# EAGLE schematic mainboard (EAGLE 7.7.0), part 1 of 2
ACCOUNT_NAME: 2aaeli-gr; BRD_SHEET_NAME: Layout Work; PROJEKT_NAME: elmProject; REVISION: 2.0; SCH_SHEET_NAME: Schaltplan; USER_NAME: A.Flo/G.Raf/S.Sve
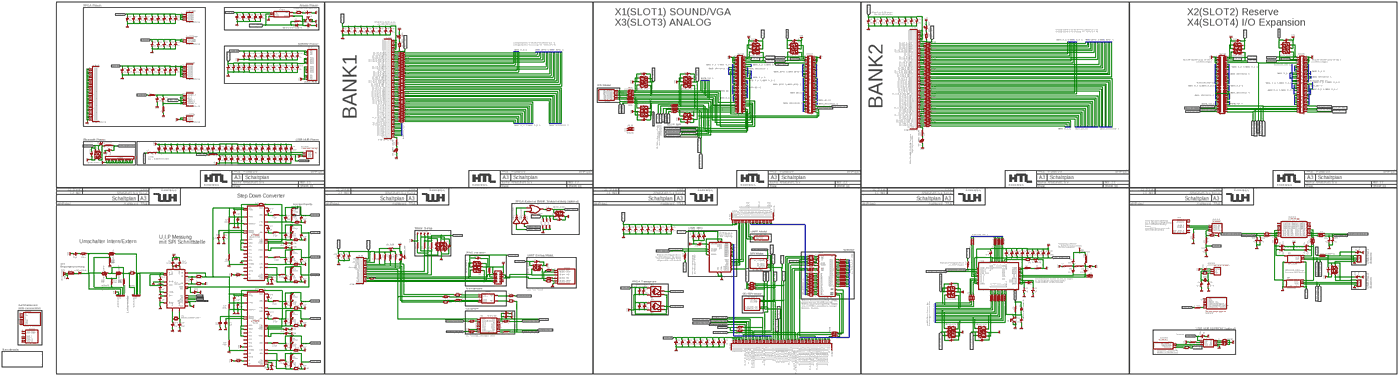
[diagram p0: schematic, sheet 1, overview]
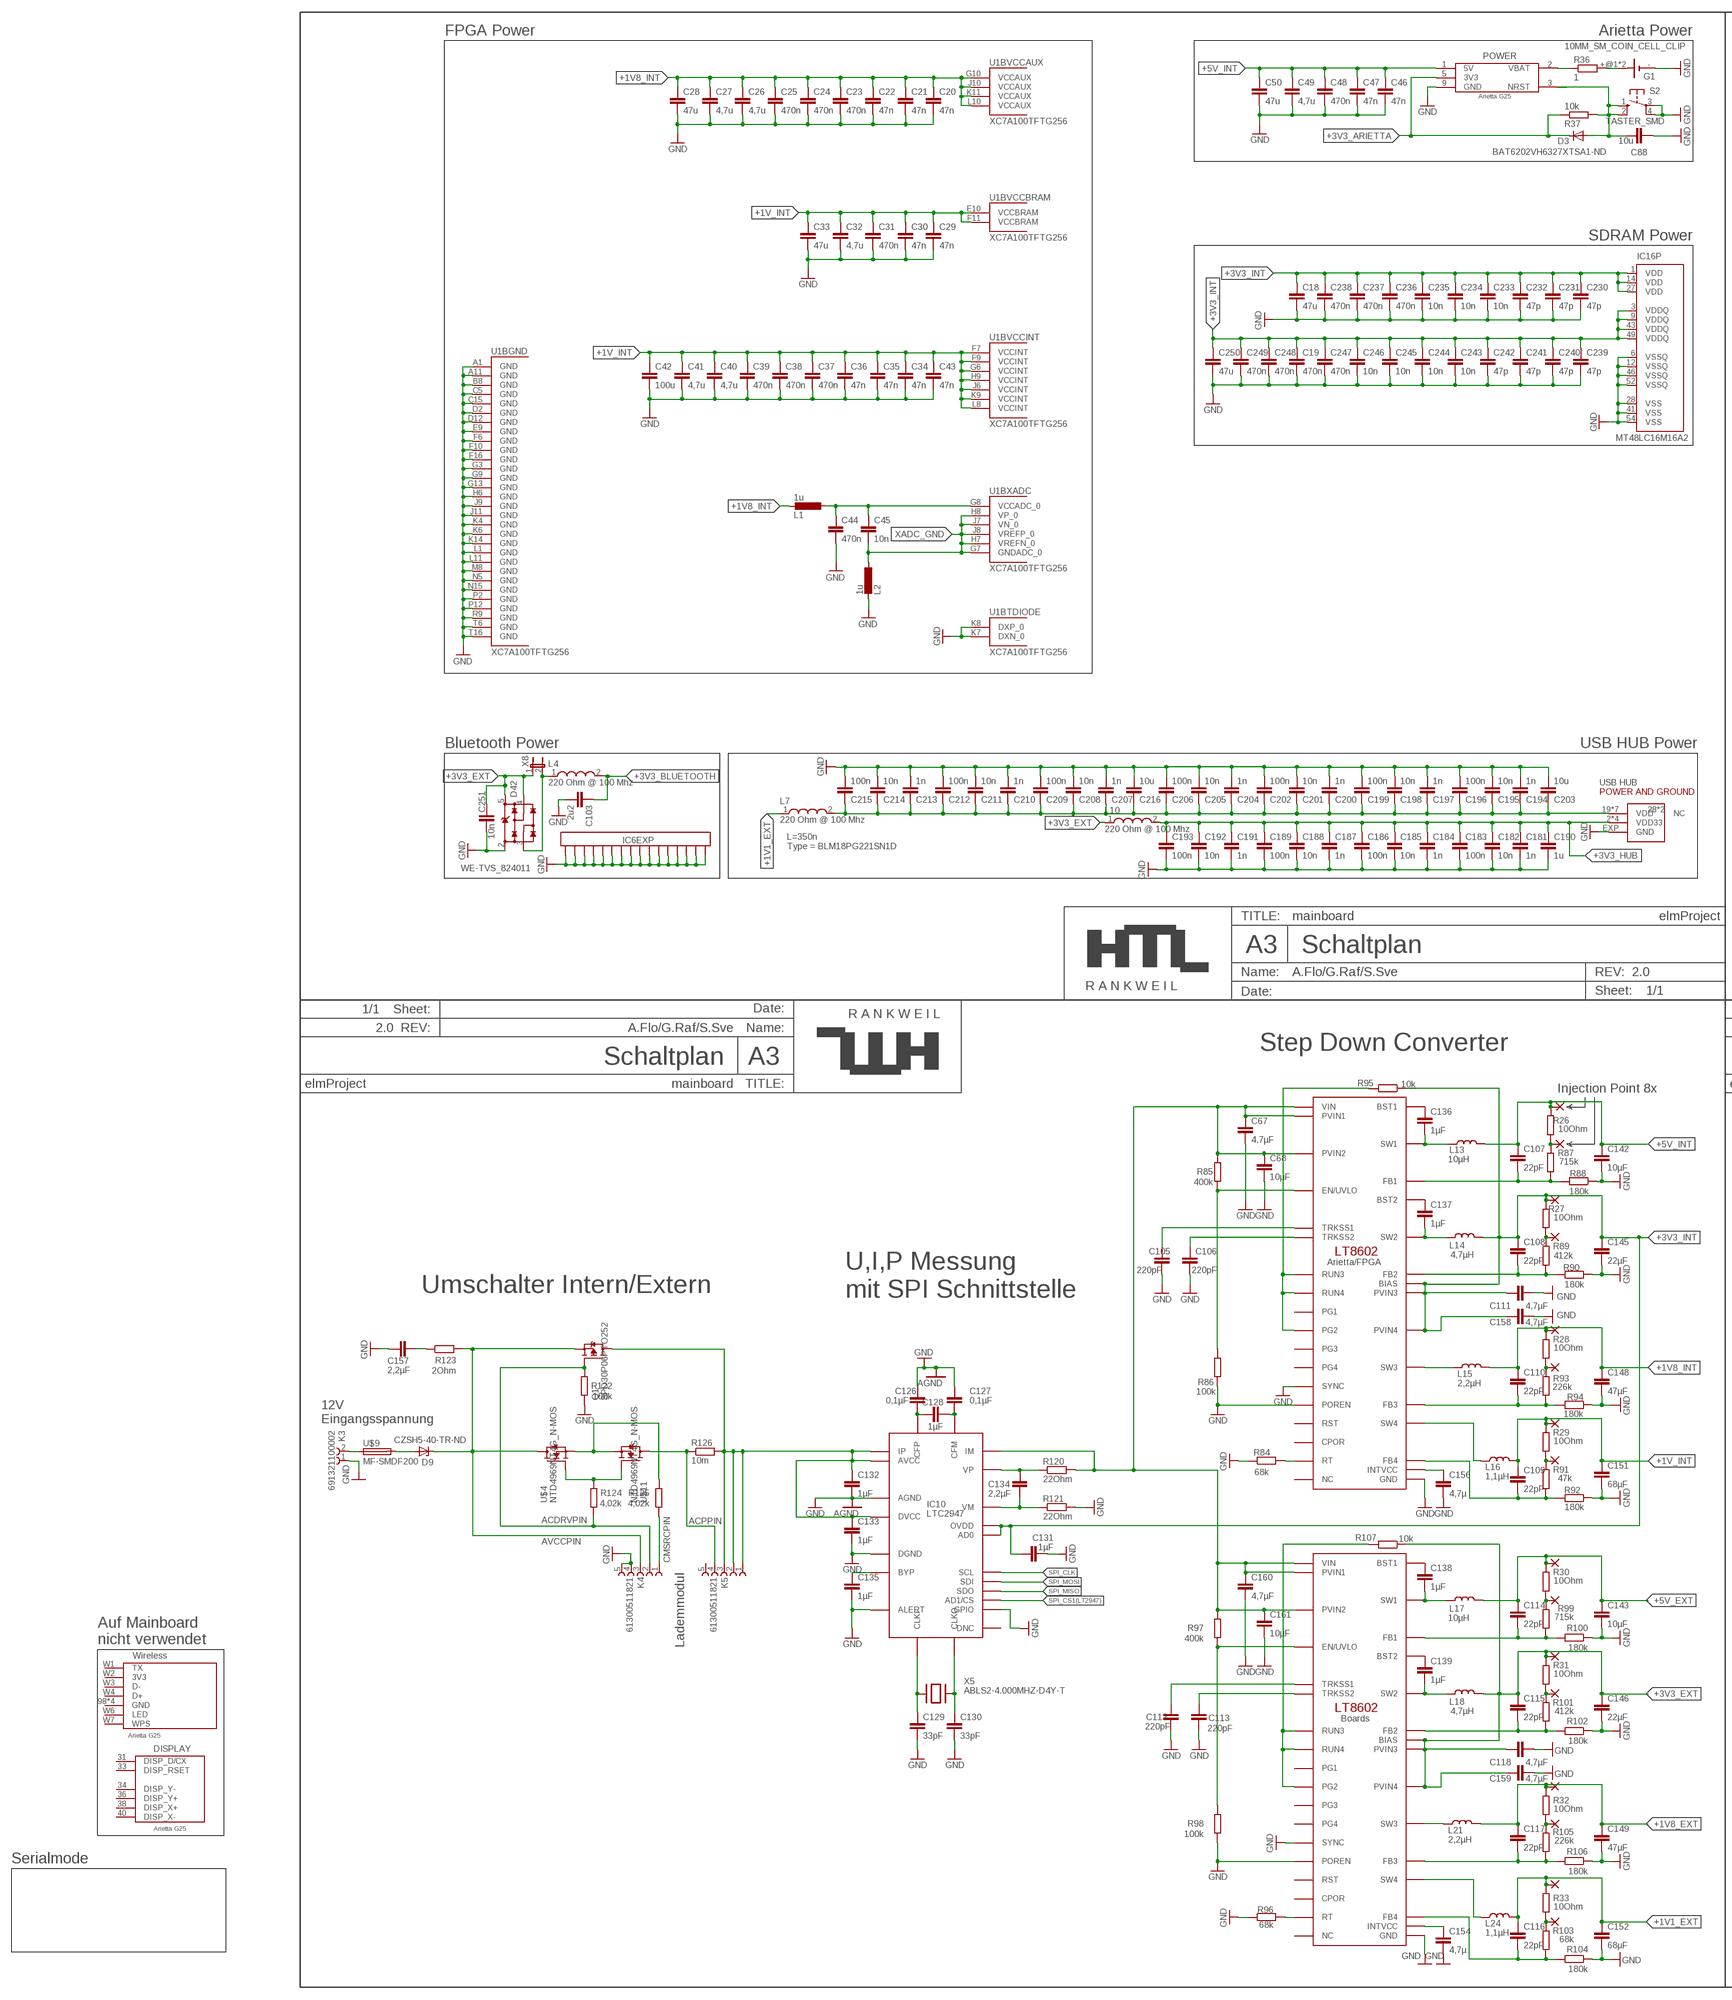
[diagram p1: schematic, sheet 1, part 1 of 5]
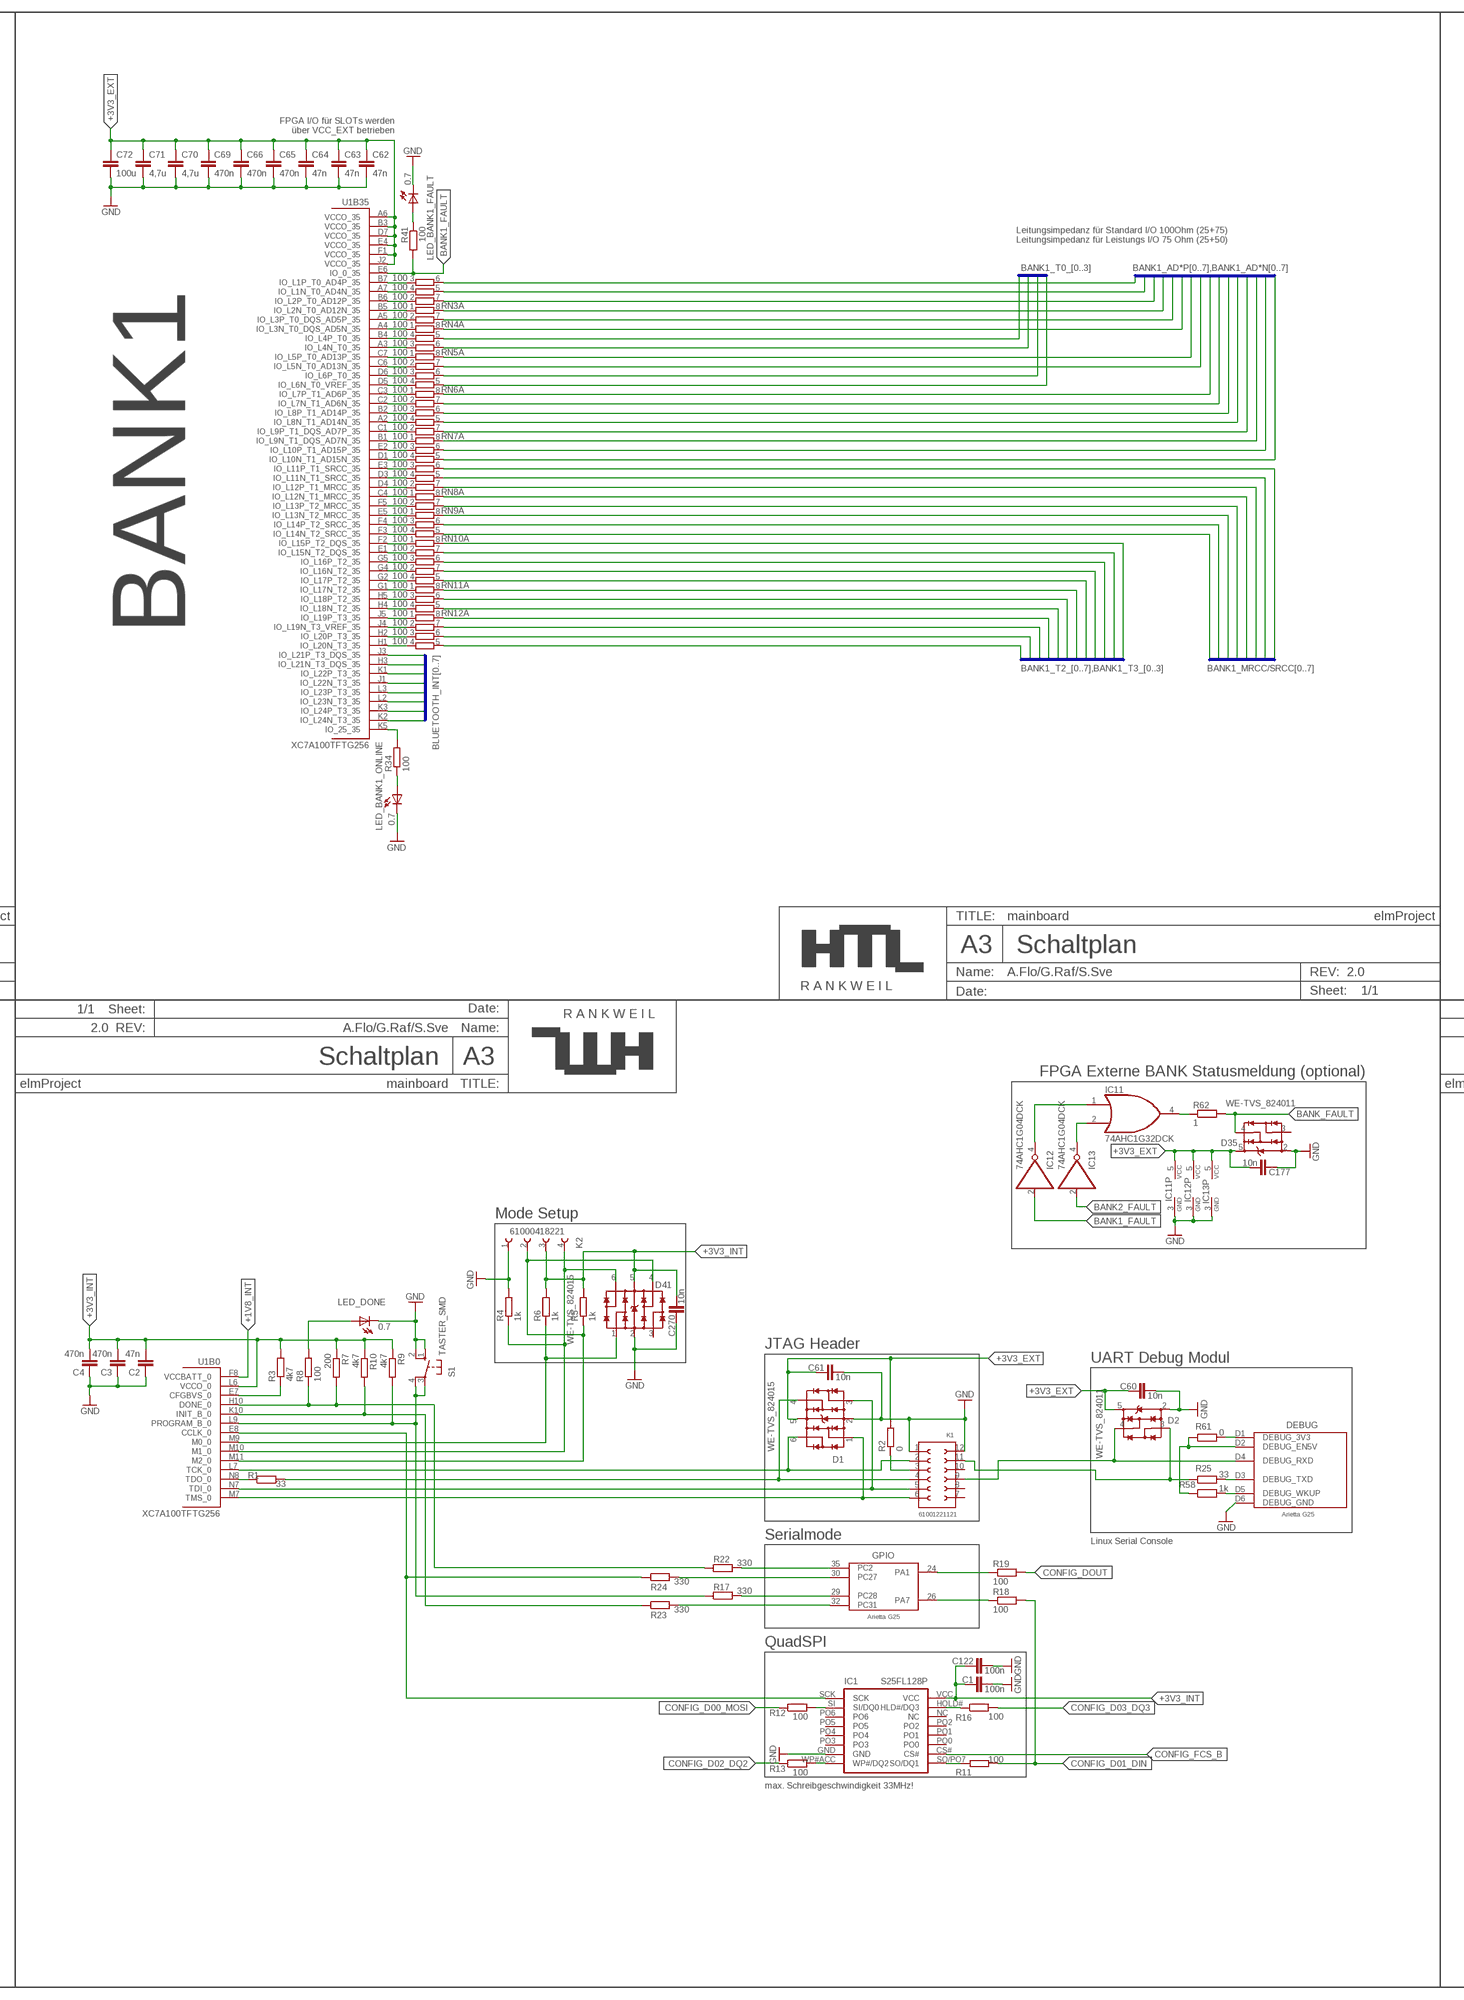
[diagram p2: schematic, sheet 1, part 2 of 5]
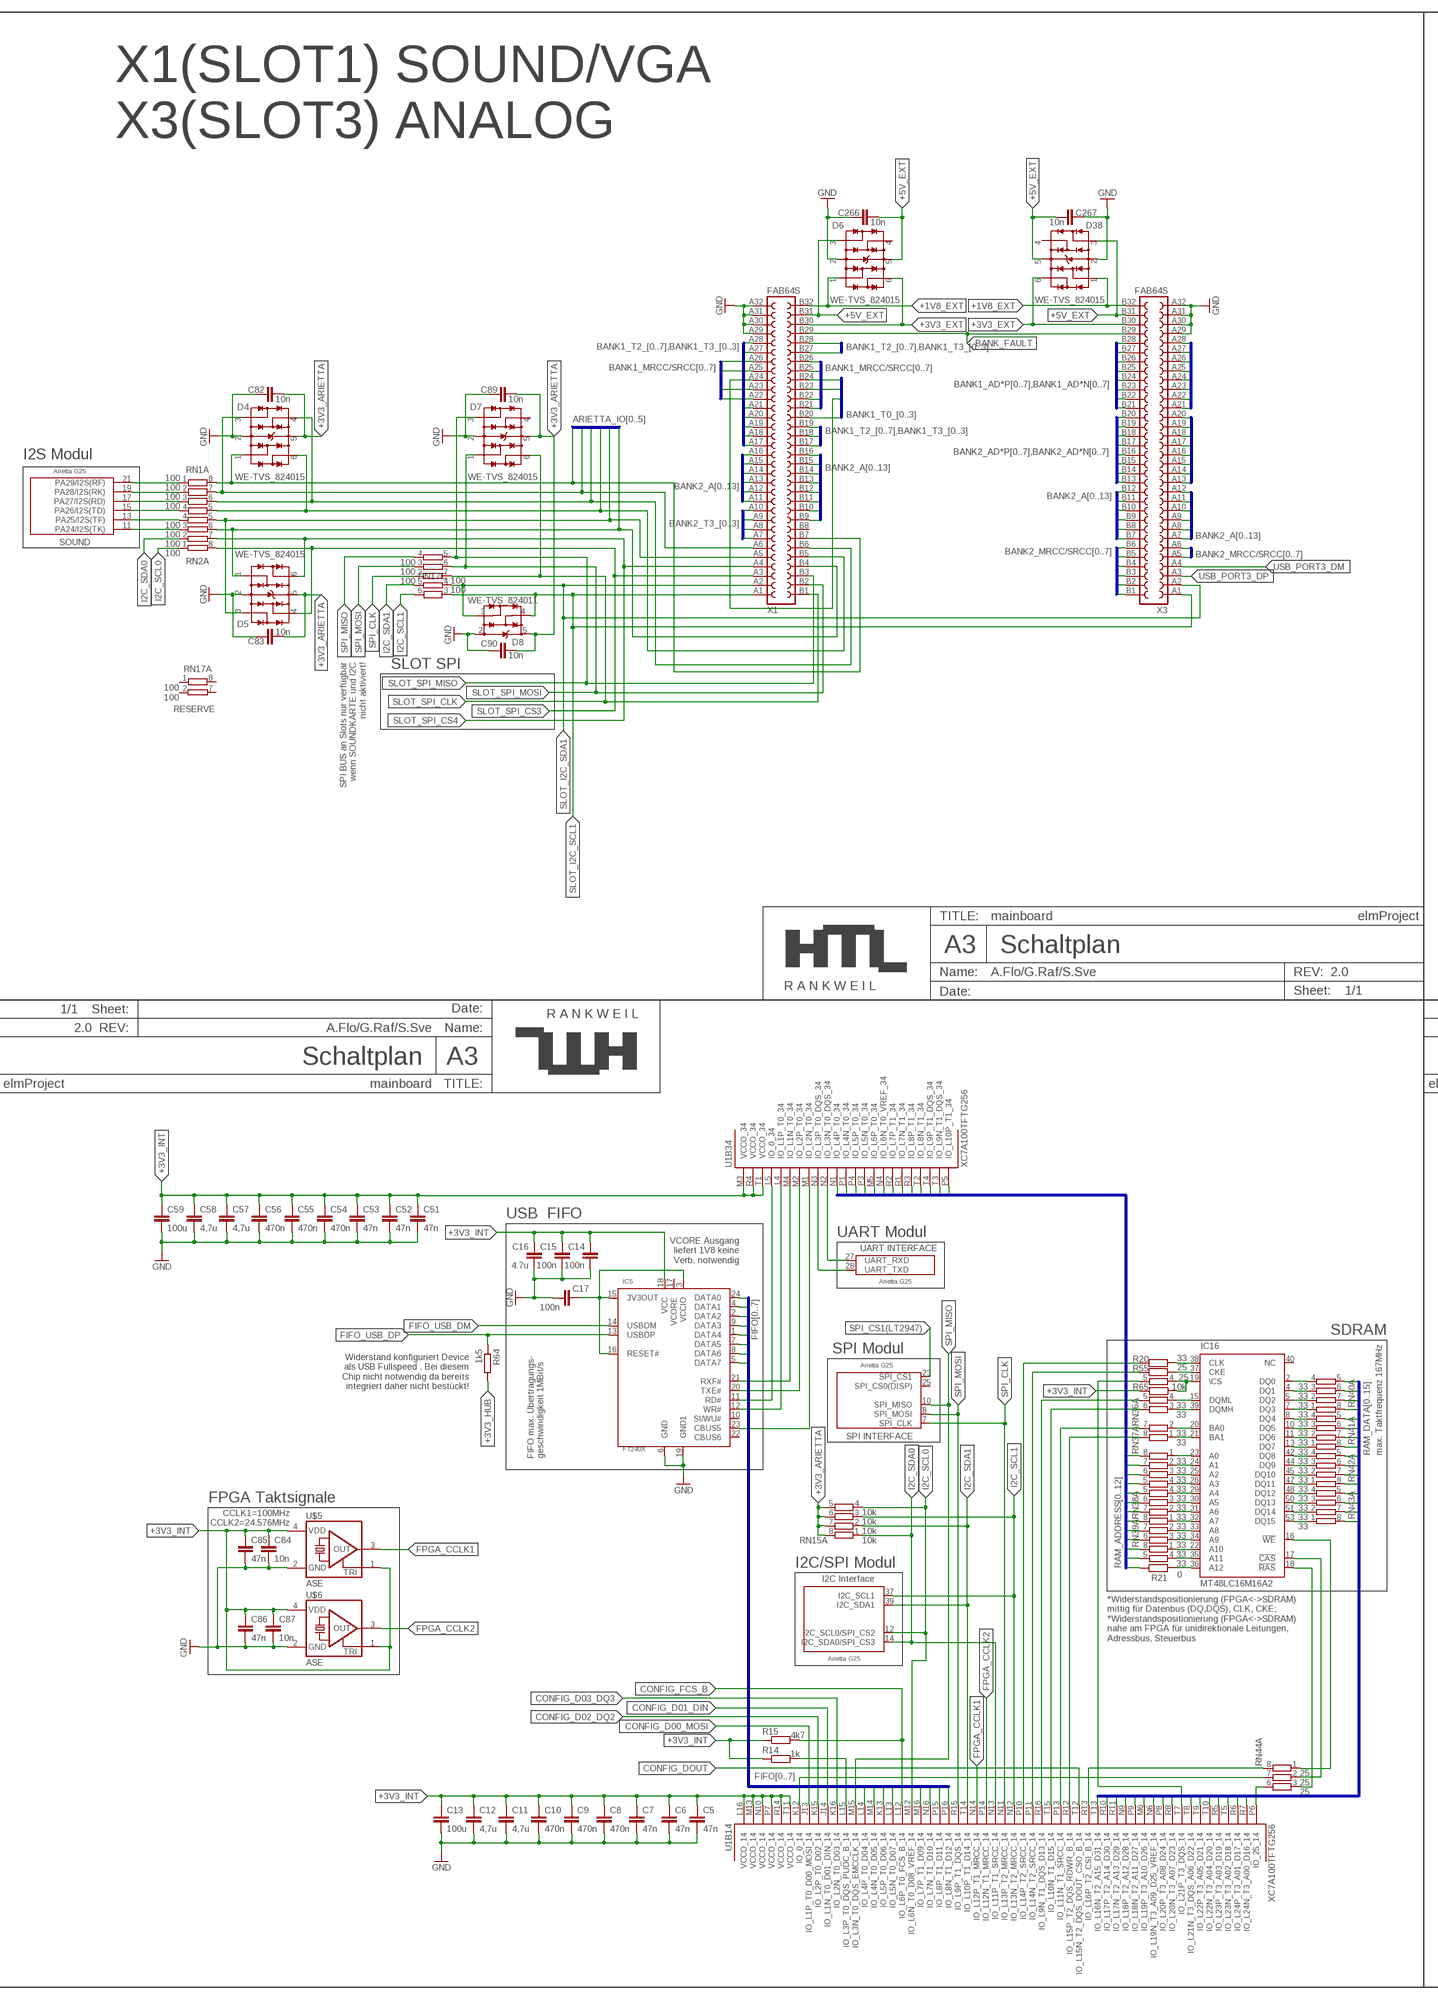
[diagram p3: schematic, sheet 1, part 3 of 5]
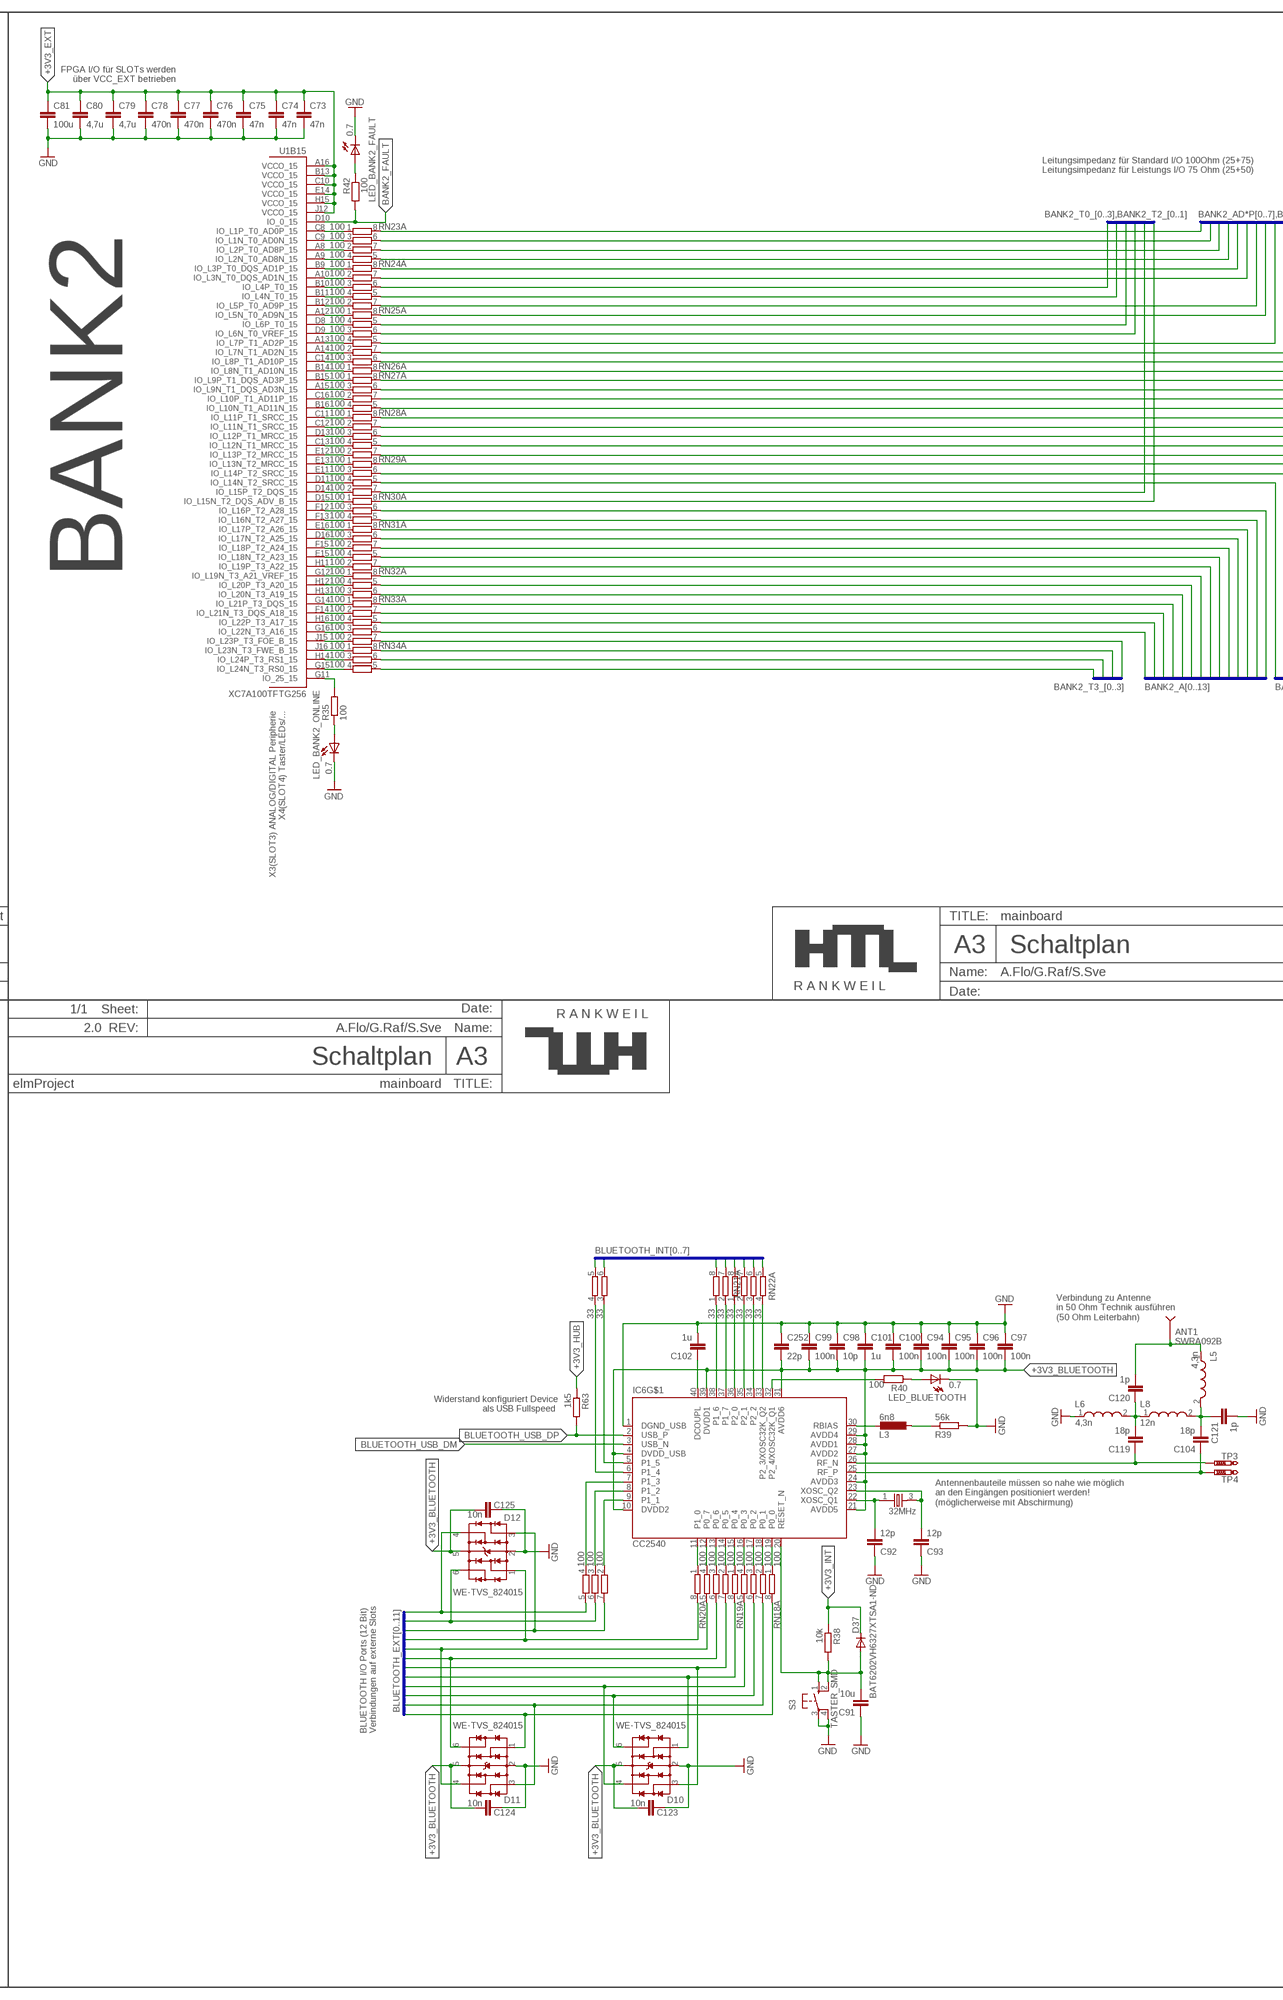
[diagram p4: schematic, sheet 1, part 4 of 5]
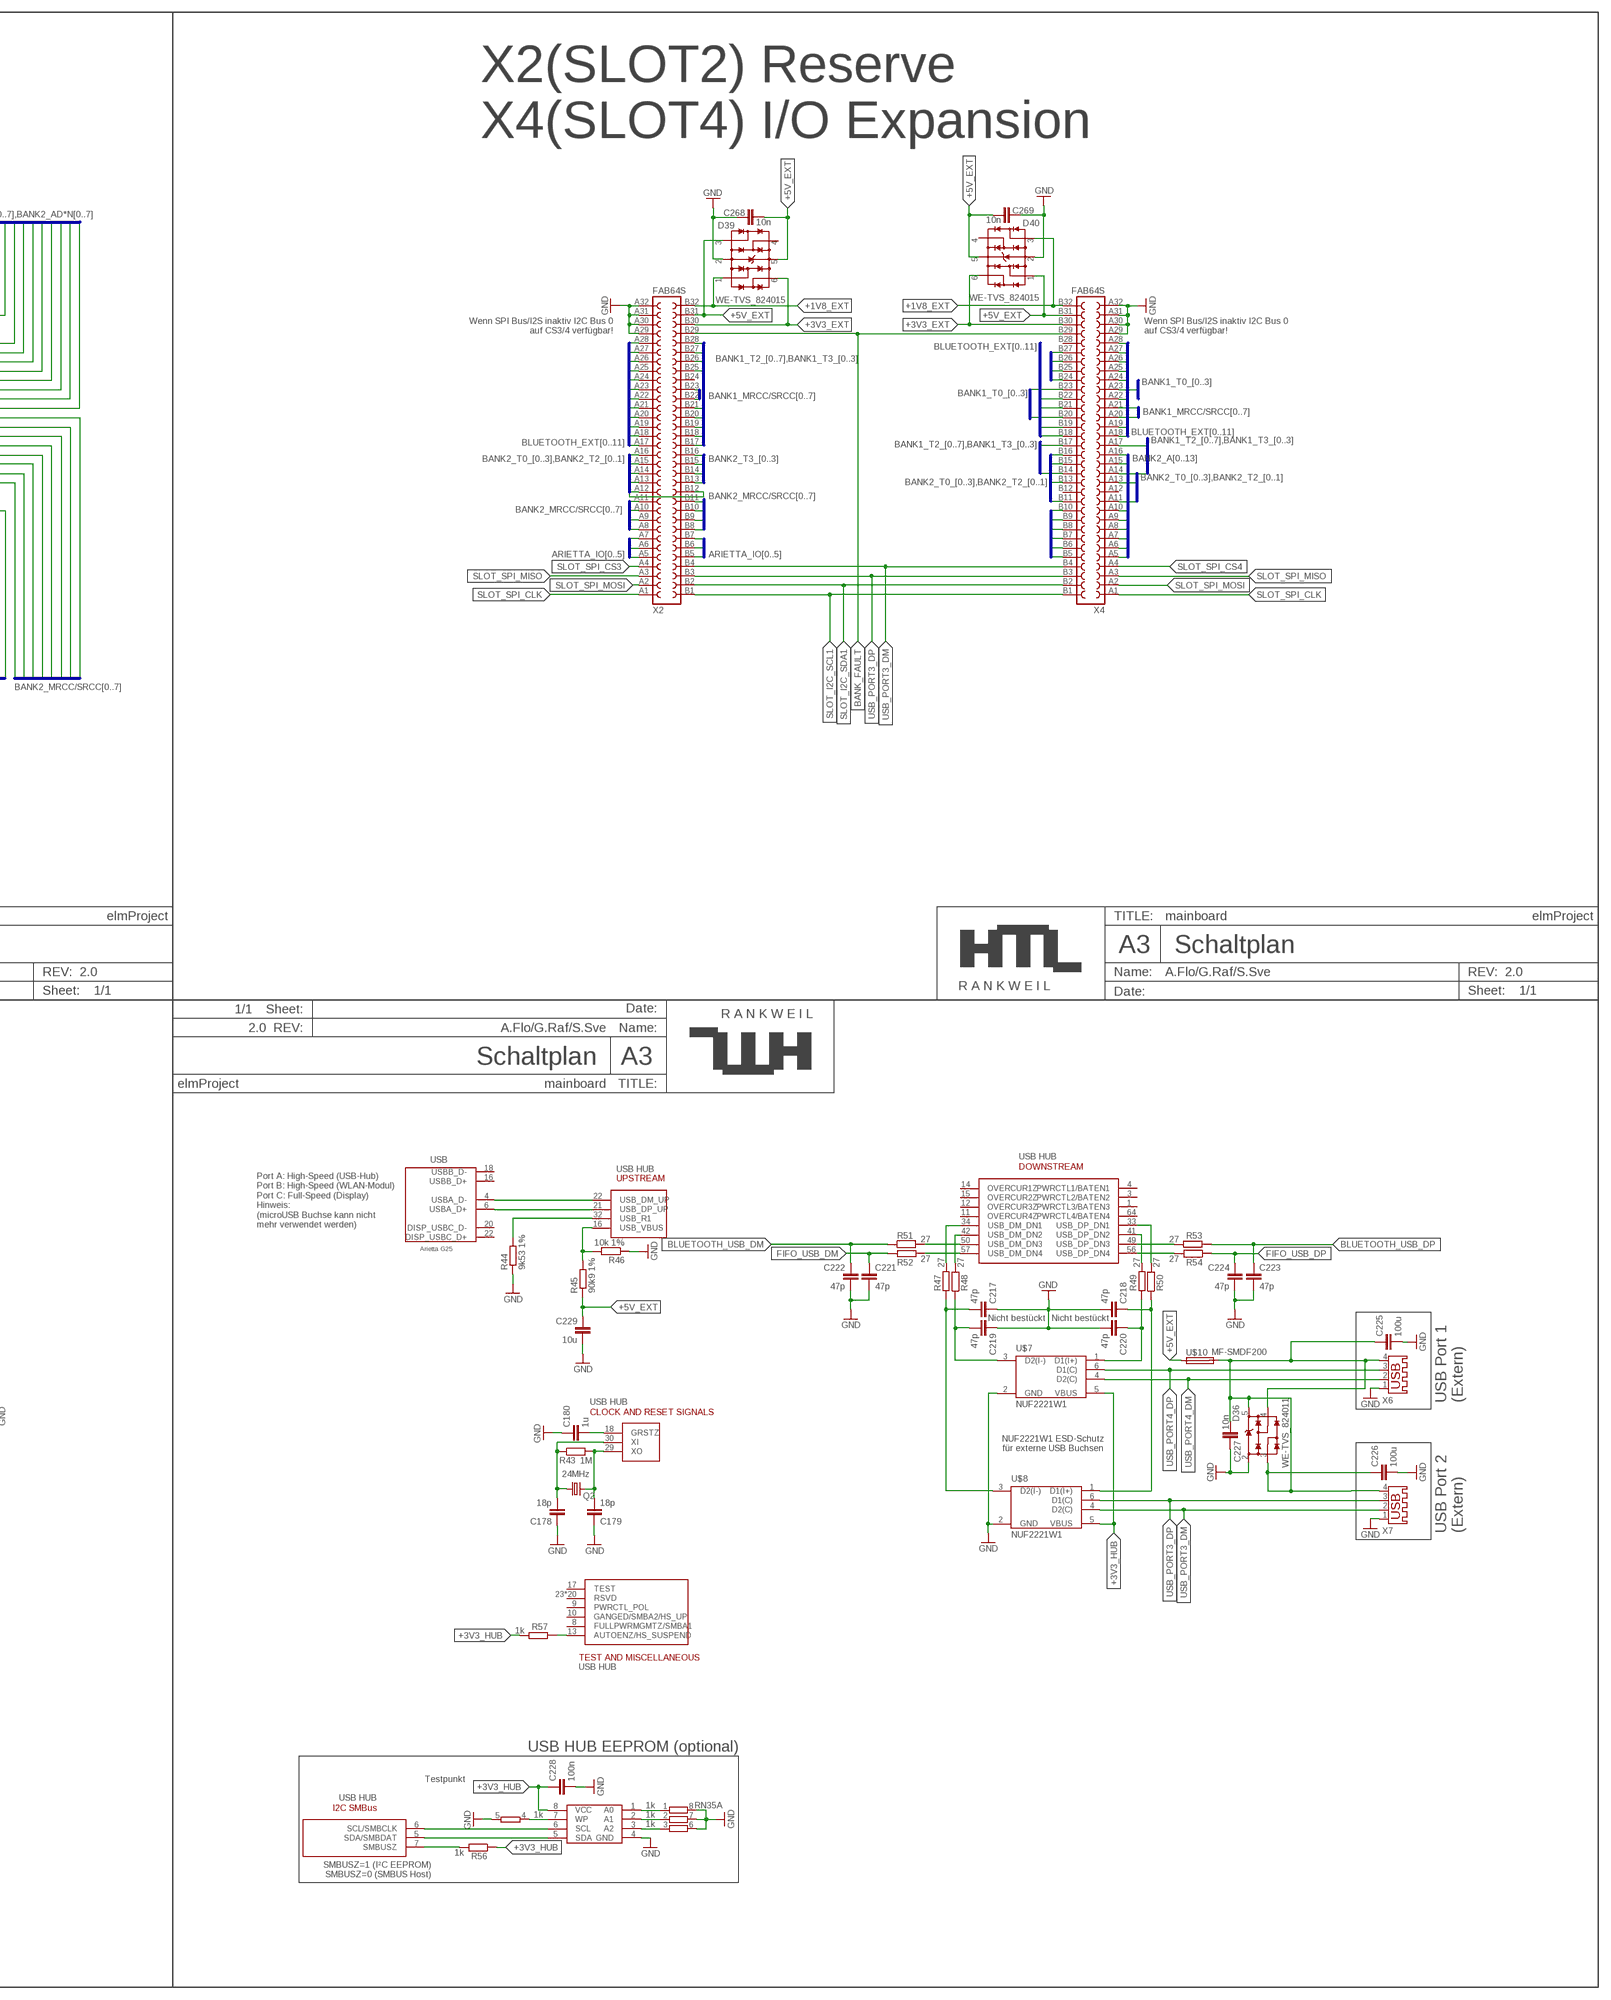
[diagram p5: schematic, sheet 1, part 5 of 5]

## Parts
ANT1  SWRA092B  [SWRA092B]
C1  100n  C-EUC0402  [C0402]
C2  47n  C-EUC0402  [C0402]
C3  470n  C-EUC0402  [C0402]
C4  470n  C-EUC0402  [C0402]
C5  47n  C-EUC0402  [C0402]
C6  47n  C-EUC0402  [C0402]
C7  47n  C-EUC0402  [C0402]
C8  470n  C-EUC0402  [C0402]
C9  470n  C-EUC0402  [C0402]
C10  470n  C-EUC0402  [C0402]
C11  4,7u  C-EUC0603  [C0603]
C12  4,7u  C-EUC0603  [C0603]
C13  100u  C-EUC1206  [C1206]
C14  100n  C-EUC0402  [C0402]
C15  100n  C-EUC0402  [C0402]
C16  4.7u  C-EUC0603  [C0603]
C17  100n  C-EUC0402  [C0402]
C18  47u  C-EUC0603  [C0603]
C19  470n  C-EUC0603  [C0603]
C20  47n  C-EUC0402  [C0402]
C21  47n  C-EUC0402  [C0402]
C22  47n  C-EUC0402  [C0402]
C23  470n  C-EUC0402  [C0402]
C24  470n  C-EUC0402  [C0402]
C25  470n  C-EUC0402  [C0402]
C26  4,7u  C-EUC0603  [C0603]
C27  4,7u  C-EUC0603  [C0603]
C28  47u  C-EUC0603  [C0603]
C29  47n  C-EUC0402  [C0402]
C30  47n  C-EUC0402  [C0402]
C31  470n  C-EUC0402  [C0402]
C32  4,7u  C-EUC0603  [C0603]
C33  47u  C-EUC0603  [C0603]
C34  47n  C-EUC0402  [C0402]
C35  47n  C-EUC0402  [C0402]
C36  47n  C-EUC0402  [C0402]
C37  470n  C-EUC0402  [C0402]
C38  470n  C-EUC0402  [C0402]
C39  470n  C-EUC0402  [C0402]
C40  4,7u  C-EUC0603  [C0603]
C41  4,7u  C-EUC0603  [C0603]
C42  100u  C-EUC1206  [C1206]
C43  47n  C-EUC0402  [C0402]
C44  470n  C-EUC0402  [C0402]
C45  10n  C-EUC0402  [C0402]
C46  47n  C-EUC0603  [C0603]
C47  47n  C-EUC0603  [C0603]
C48  470n  C-EUC0603  [C0603]
C49  4,7u  C-EUC0603  [C0603]
C50  47u  C-EUC0603  [C0603]
C51  47n  C-EUC0402  [C0402]
C52  47n  C-EUC0402  [C0402]
C53  47n  C-EUC0402  [C0402]
C54  470n  C-EUC0402  [C0402]
C55  470n  C-EUC0402  [C0402]
C56  470n  C-EUC0402  [C0402]
C57  4,7u  C-EUC0603  [C0603]
C58  4,7u  C-EUC0603  [C0603]
C59  100u  C-EUC1206  [C1206]
C60  10n  C-EUC0603  [C0603]
C61  10n  C-EUC0603  [C0603]
C62  47n  C-EUC0402  [C0402]
C63  47n  C-EUC0402  [C0402]
C64  47n  C-EUC0402  [C0402]
C65  470n  C-EUC0402  [C0402]
C66  470n  C-EUC0402  [C0402]
C67  4,7µF  C-EUC0603  [C0603]
C68  10µF  C-EUC0603  [C0603]
C69  470n  C-EUC0402  [C0402]
C70  4,7u  C-EUC0603  [C0603]
C71  4,7u  C-EUC0603  [C0603]
C72  100u  C-EUC1206  [C1206]
C73  47n  C-EUC0402  [C0402]
C74  47n  C-EUC0402  [C0402]
C75  47n  C-EUC0402  [C0402]
C76  470n  C-EUC0402  [C0402]
C77  470n  C-EUC0402  [C0402]
C78  470n  C-EUC0402  [C0402]
C79  4,7u  C-EUC0603  [C0603]
C80  4,7u  C-EUC0603  [C0603]
C81  100u  C-EUC1206  [C1206]
C82  10n  C-EUC0402  [C0402]
C83  10n  C-EUC0402  [C0402]
C84  10n  C-EUC0402  [C0402]
C85  47n  C-EUC0402  [C0402]
C86  47n  C-EUC0402  [C0402]
C87  10n  C-EUC0402  [C0402]
C88  10u  C-EUC0603  [C0603]
C89  10n  C-EUC0402  [C0402]
C90  10n  C-EUC0402  [C0402]
C91  10u  C-EUC0603  [C0603]
C92  12p  C-EUC0402  [C0402]
C93  12p  C-EUC0402  [C0402]
C94  100n  C-EUC0402  [C0402]
C95  100n  C-EUC0402  [C0402]
C96  100n  C-EUC0402  [C0402]
C97  100n  C-EUC0402  [C0402]
C98  10p  C-EUC0402  [C0402]
C99  100n  C-EUC0402  [C0402]
C100  100n  C-EUC0402  [C0402]
C101  1u  C-EUC0603  [C0603]
C102  1u  C-EUC0402  [C0402]
C103  2u2  C-EUC0603  [C0603]
C104  18p  C-EUC0402  [C0402]
C105  220pF  C-0603  [C0603]
C106  220pF  C-0603  [C0603]
C107  22pF  C-0603  [C0603]
C108  22pF  C-0603  [C0603]
C109  22pF  C-0603  [C0603]
C110  22pF  C-0603  [C0603]
C111  4,7µF  C-0603  [C0603]
C112  220pF  C-0603  [C0603]
C113  220pF  C-0603  [C0603]
C114  22pF  C-0603  [C0603]
C115  22pF  C-0603  [C0603]
C116  22pF  C-0603  [C0603]
C117  22pF  C-0603  [C0603]
C118  4,7µF  C-0603  [C0603]
C119  18p  C-EUC0402  [C0402]
C120  1p  C-EUC0402  [C0402]
C121  1p  C-EUC0402  [C0402]
C122  100n  C-EUC0402  [C0402]
C123  10n  C-EUC0402  [C0402]
C124  10n  C-EUC0402  [C0402]
C125  10n  C-EUC0402  [C0402]
C126  0,1µF  C-0603  [C0603]
C127  0,1µF  C-0603  [C0603]
C128  1µF  C-0603  [C0603]
C129  33pF  C-0402  [C0402]
C130  33pF  C-0402  [C0402]
C131  1µF  C-0603  [C0603]
C132  1µF  C-0603  [C0603]
C133  1µF  C-0603  [C0603]
C134  2,2µF  C-0603  [C0603]
C135  1µF  C-0603  [C0603]
C136  1µF  C-0603  [C0603]
C137  1µF  C-0603  [C0603]
C138  1µF  C-0603  [C0603]
C139  1µF  C-0603  [C0603]
C142  10µF  C-EUC0603  [C0603]
C143  10µF  C-EUC0603  [C0603]
C145  22µF  C-EUC0603  [C0603]
C146  22µF  C-EUC0603  [C0603]
C148  47µF  C-EUC0603  [C0603]
C149  47µF  C-EUC0603  [C0603]
C151  68µF  C-EUC1206  [C1206]
C152  68µF  C-EUC1206  [C1206]
C154  4,7µ  C-EUC0603  [C0603]
C156  4,7µ  C-EUC0603  [C0603]
C157  2,2µF  C-EUC1206K  [C1206K]
C158  4,7µF  C-0603  [C0603]
C159  4,7µF  C-0603  [C0603]
C160  4,7µF  C-EUC0603  [C0603]
C161  10µF  C-EUC0603  [C0603]
C177  10n  C-EUC0603  [C0603]
C178  18p  C-EUC0402  [C0402]
C179  18p  C-EUC0402  [C0402]
C180  1u  C-EUC0603  [C0603]
C181  1n  C-EUC0402  [C0402]
C182  10n  C-EUC0402  [C0402]
C183  100n  C-EUC0402  [C0402]
C184  1n  C-EUC0402  [C0402]
C185  10n  C-EUC0402  [C0402]
C186  100n  C-EUC0402  [C0402]
C187  1n  C-EUC0402  [C0402]
C188  10n  C-EUC0402  [C0402]
C189  100n  C-EUC0402  [C0402]
C190  1u  C-EUC0603  [C0603]
C191  1n  C-EUC0402  [C0402]
C192  10n  C-EUC0402  [C0402]
C193  100n  C-EUC0402  [C0402]
C194  1n  C-EUC0402  [C0402]
C195  10n  C-EUC0402  [C0402]
C196  100n  C-EUC0402  [C0402]
C197  1n  C-EUC0402  [C0402]
C198  10n  C-EUC0402  [C0402]
C199  100n  C-EUC0402  [C0402]
C200  1n  C-EUC0402  [C0402]
C201  10n  C-EUC0402  [C0402]
C202  100n  C-EUC0402  [C0402]
C203  10u  C-EUC0603  [C0603]
C204  1n  C-EUC0402  [C0402]
C205  10n  C-EUC0402  [C0402]
C206  100n  C-EUC0402  [C0402]
C207  1n  C-EUC0402  [C0402]
C208  10n  C-EUC0402  [C0402]
C209  100n  C-EUC0402  [C0402]
C210  1n  C-EUC0402  [C0402]
C211  10n  C-EUC0402  [C0402]
C212  100n  C-EUC0402  [C0402]
C213  1n  C-EUC0402  [C0402]
C214  10n  C-EUC0402  [C0402]
C215  100n  C-EUC0402  [C0402]
C216  10u  C-EUC0603  [C0603]
C217  47p  C-EUC0402  [C0402]
C218  47p  C-EUC0402  [C0402]
C219  47p  C-EUC0402  [C0402]
C220  47p  C-EUC0402  [C0402]
C221  47p  C-EUC0402  [C0402]
C222  47p  C-EUC0402  [C0402]
C223  47p  C-EUC0402  [C0402]
C224  47p  C-EUC0402  [C0402]
C225  100u  C-EUC1206  [C1206]
C226  100u  C-EUC1206  [C1206]
C227  10n  C-EUC0603  [C0603]
C228  100n  C-EUC0402  [C0402]
C229  10u  C-EUC0603  [C0603]
C230  47p  C-EUC0402  [C0402]
C231  47p  C-EUC0402  [C0402]
C232  47p  C-EUC0402  [C0402]
C233  10n  C-EUC0402  [C0402]
C234  10n  C-EUC0402  [C0402]
C235  10n  C-EUC0402  [C0402]
C236  470n  C-EUC0603  [C0603]
C237  470n  C-EUC0603  [C0603]
C238  470n  C-EUC0603  [C0603]
C239  47p  C-EUC0402  [C0402]
C240  47p  C-EUC0402  [C0402]
C241  47p  C-EUC0402  [C0402]
C242  47p  C-EUC0402  [C0402]
C243  10n  C-EUC0402  [C0402]
C244  10n  C-EUC0402  [C0402]
C245  10n  C-EUC0402  [C0402]
C246  10n  C-EUC0402  [C0402]
C247  470n  C-EUC0402  [C0402]
C248  470n  C-EUC0603  [C0603]
C249  470n  C-EUC0603  [C0603]
C250  47u  C-EUC0603  [C0603]
C251  10n  C-EUC0603  [C0603]
C252  22p  C-EUC0402  [C0402]
C266  10n  C-EUC0603  [C0603]
C267  10n  C-EUC0603  [C0603]
C268  10n  C-EUC0603  [C0603]
C269  10n  C-EUC0603  [C0603]
C270  10n  C-EUC0603  [C0603]
D1  WE-TVS_824015  [WE-TVS_SOT23-6L]
D2  WE-TVS_824011  [WE-TVS_SOT23-5L]
D3  BAT6202VH6327XTSA1-ND  DIODE-SOD523  [SOD523]
D4  WE-TVS_824015  [WE-TVS_SOT23-6L]
D5  WE-TVS_824015  [WE-TVS_SOT23-6L]
D6  WE-TVS_824015  [WE-TVS_SOT23-6L]
D7  WE-TVS_824015  [WE-TVS_SOT23-6L]
D8  WE-TVS_824011  [WE-TVS_SOT23-5L]
D9  CZSH5-40-TR-ND  ZENER-DIODESOT223  [SOT223]
D10  WE-TVS_824015  [WE-TVS_SOT23-6L]
D11  WE-TVS_824015  [WE-TVS_SOT23-6L]
D12  WE-TVS_824015  [WE-TVS_SOT23-6L]
D35  WE-TVS_824011  [WE-TVS_SOT23-5L]
D36  WE-TVS_824011  [WE-TVS_SOT23-5L]
D37  BAT6202VH6327XTSA1-ND  DIODE-SOD523  [SOD523]
D38  WE-TVS_824015  [WE-TVS_SOT23-6L]
D39  WE-TVS_824015  [WE-TVS_SOT23-6L]
D40  WE-TVS_824015  [WE-TVS_SOT23-6L]
D41  WE-TVS_824015  [WE-TVS_SOT23-6L]
D42  WE-TVS_824011  [WE-TVS_SOT23-5L]
FRAME1  HTL-A3-HA3H  [HTL-A3-H]
FRAME2  HTL-A3-HA3H  [HTL-A3-H]
FRAME3  HTL-A3-HA3H  [HTL-A3-H]
FRAME4  HTL-A3-HA3H  [HTL-A3-H]
FRAME5  HTL-A3-HA3H  [HTL-A3-H]
FRAME6  HTL-A3-HA3H  [HTL-A3-H]
FRAME7  HTL-A3-HA3H  [HTL-A3-H]
FRAME8  HTL-A3-HA3H  [HTL-A3-H]
FRAME9  HTL-A3-HA3H  [HTL-A3-H]
FRAME10  HTL-A3-HA3H  [HTL-A3-H]
G1  10MM_SM_COIN_CELL_CLIP  [10MM_SM_COIN_CELL_CLIP]
IC1  S25FL128P  [S25FL128P]
IC5  FT240X  [SSOP24-0.635-8.65X4MM]
IC6  CC2540  [QFN40-6X6]
IC7  Arietta/FPGA  LT8602  [LT8602]
IC8  Boards  LT8602  [LT8602]
IC9  TUSB4041I  [HTQFP-64-EXP]
IC10  LTC2947  [LTC2947]
IC11  74AHC1G32DCK  [SC70-5]
IC12  74AHC1G04DCK  [SC70-5]
IC13  74AHC1G04DCK  [SC70-5]
IC14  EEPROM  [SOIC-8]
IC16  MT48LC16M16A2  [TSOP54-400]
K1  61001221121  [61001221121]
K2  61000418221  [61000418221]
K3  691321100002  [691321100002]
K4  61300511821  [61300511821]
K5  61300511821  [61300511821]
L1  1u  L-EUL2012C  [L2012C]
L2  1u  L-EUL2012C  [L2012C]
L3  6n8  L-EUL2012C  [L2012C]
L4  220 Ohm @ 100 Mhz  WE-KI_0603_B  [WE-KI_0603_B]
L5  4,3n  WE-KI_0402A  [WE-KI_0402A]
L6  4,3n  WE-KI_0402A  [WE-KI_0402A]
L7  220 Ohm @ 100 Mhz  WE-KI_0603_B  [WE-KI_0603_B]
L8  12n  WE-KI_0402A  [WE-KI_0402A]
L10  220 Ohm @ 100 Mhz  WE-KI_0603_B  [WE-KI_0603_B]
L13  10µH  NR6028T100M  [NR6028T100M]
L14  4,7µH  NR6028T100M  [NR6028T100M]
L15  2,2µH  IHHP-0806AZ-01  [IHHP-0806AZ-01]
L16  1,1µH  SRN3012TA  [SRN3012TA]
L17  10µH  NR6028T100M  [NR6028T100M]
L18  4,7µH  NR6028T100M  [NR6028T100M]
L21  2,2µH  IHHP-0806AZ-01  [IHHP-0806AZ-01]
L24  1,1µH  SRN3012TA  [SRN3012TA]
LED_BANK1_FAULT  0.7  LED  [SMARTLED-TTW]
LED_BANK1_ONLINE  0.7  LED  [SMARTLED-TTW]
LED_BANK2_FAULT  0.7  LED  [SMARTLED-TTW]
LED_BANK2_ONLINE  0.7  LED  [SMARTLED-TTW]
LED_BLUETOOTH  0.7  LED  [SMARTLED-TTW]
LED_DONE  0.7  LED  [SMARTLED-TTW]
PAD1  SMD2  [SMD1,27-2,54]
PAD2  SMD2  [SMD1,27-2,54]
PAD3  SMD2  [SMD1,27-2,54]
PAD4  SMD2  [SMD1,27-2,54]
PAD5  SMD2  [SMD1,27-2,54]
PAD6  SMD2  [SMD1,27-2,54]
PAD7  SMD2  [SMD1,27-2,54]
PAD8  SMD2  [SMD1,27-2,54]
PAD9  SMD2  [SMD1,27-2,54]
PAD10  SMD2  [SMD1,27-2,54]
PAD11  SMD2  [SMD1,27-2,54]
PAD12  SMD2  [SMD1,27-2,54]
PAD13  SMD2  [SMD1,27-2,54]
PAD14  SMD2  [SMD1,27-2,54]
PAD15  SMD2  [SMD1,27-2,54]
PAD16  SMD2  [SMD1,27-2,54]
Q1  SPD30P06PTO252  [TO252]
Q2  24MHz  CRYSTALCTS406  [CTS406]
Q3  32MHz  CTS403  [CTS402_3.2X2.5]
R1  33  R-EU_R0402  [R0402]
R2  0  R-EU_R0402  [R0402]
R3  4k7  R-EU_R0402  [R0402]
R4  1k  R-EU_R0402  [R0402]
R5  1k  R-EU_R0402  [R0402]
R6  1k  R-EU_R0402  [R0402]
R7  200  R-EU_R0402  [R0402]
R8  100  R-EU_R0402  [R0402]
R9  4k7  R-EU_R0402  [R0402]
R10  4k7  R-EU_R0402  [R0402]
R11  100  R-EU_R0402  [R0402]
R12  100  R-EU_R0402  [R0402]
R13  100  R-EU_R0402  [R0402]
R14  1k  R-EU_R0402  [R0402]
R15  4k7  R-EU_R0402  [R0402]
R16  100  R-EU_R0402  [R0402]
R17  330  R-EU_R0402  [R0402]
R18  100  R-EU_R0402  [R0402]
R19  100  R-EU_R0402  [R0402]
R20  33  R-EU_R0402  [R0402]
R21  0  R-EU_R0402  [R0402]
R22  330  R-EU_R0402  [R0402]
R23  330  R-EU_R0402  [R0402]
R24  330  R-EU_R0402  [R0402]
R25  33  R-EU_R0402  [R0402]
R26  10Ohm  R-0603  [R0603]
R27  10Ohm  R-0603  [R0603]
R28  10Ohm  R-0603  [R0603]
R29  10Ohm  R-0603  [R0603]
R30  10Ohm  R-0603  [R0603]
R31  10Ohm  R-0603  [R0603]
R32  10Ohm  R-0603  [R0603]
R33  10Ohm  R-0603  [R0603]
R34  100  R-EU_R0402  [R0402]
R35  100  R-EU_R0402  [R0402]
R36  1  R-EU_R0402  [R0402]
R37  10k  R-EU_R0603  [R0603]
R38  10k  R-EU_R0603  [R0603]
R39  56k  R-EU_R0603  [R0603]
R40  100  R-EU_R0402  [R0402]
R41  100  R-EU_R0402  [R0402]
R42  100  R-EU_R0402  [R0402]
R43  1M  R-EU_R0805  [R0805]
R44  9k53 1%  R-EU_R0603  [R0603]
R45  90k9 1%  R-EU_R0603  [R0603]
R46  10k 1%  R-EU_R0603  [R0603]
R47  27  R-EU_R0402  [R0402]
R48  27  R-EU_R0402  [R0402]
R49  27  R-EU_R0402  [R0402]
R50  27  R-EU_R0402  [R0402]
R51  27  R-EU_R0402  [R0402]
R52  27  R-EU_R0402  [R0402]
R53  27  R-EU_R0402  [R0402]
R54  27  R-EU_R0402  [R0402]
R55  25  R-EU_R0402  [R0402]
R56  1k  R-EU_R0402  [R0402]
R57  1k  R-EU_R0603  [R0603]
R58  1k  R-EU_R0402  [R0402]
R61  0  R-EU_R0402  [R0402]
R62  1  R-EU_R0402  [R0402]
R63  1k5  R-EU_R0402  [R0402]
R64  1k5  R-EU_R0402  [R0402]
R65  10k  R-EU_R0402  [R0402]
R84  68k  R-0603  [R0603]
R85  400k  R-0603  [R0603]
R86  100k  R-0603  [R0603]
R87  715k  R-0603  [R0603]
R88  180k  R-0603  [R0603]
R89  412k  R-0603  [R0603]
R90  180k  R-0603  [R0603]
R91  47k  R-0603  [R0603]
R92  180k  R-0603  [R0603]
R93  226k  R-0603  [R0603]
R94  180k  R-0603  [R0603]
R95  10k  R-0603  [R0603]
R96  68k  R-0603  [R0603]
R97  400k  R-0603  [R0603]
R98  100k  R-0603  [R0603]
R99  715k  R-0603  [R0603]
R100  180k  R-0603  [R0603]
R101  412k  R-0603  [R0603]
R102  180k  R-0603  [R0603]
R103  68k  R-0603  [R0603]
R104  180k  R-0603  [R0603]
R105  226k  R-0603  [R0603]
R106  180k  R-0603  [R0603]
R107  10k  R-0603  [R0603]
R120  22Ohm  R-0603  [R0603]
R121  22Ohm  R-0603  [R0603]
R122  100k  R-EU_R1206  [R1206]
R123  2Ohm  R-EU_R1206  [R1206]
R124  4,02k  R-EU_R1206  [R1206]
R125  4,02k  R-EU_R1206  [R1206]
R126  10m  R-EU_R1206  [R1206]
RN1  100  4R-NEXBV8V  [EXBV8V]
RN2  100  4R-NEXBV8V  [EXBV8V]
RN3  100  4R-NEXBV8V  [EXBV8V]
RN4  100  4R-NEXBV8V  [EXBV8V]
RN5  100  4R-NEXBV8V  [EXBV8V]
RN6  100  4R-NEXBV8V  [EXBV8V]
RN7  100  4R-NEXBV8V  [EXBV8V]
RN8  100  4R-NEXBV8V  [EXBV8V]
RN9  100  4R-NEXBV8V  [EXBV8V]
RN10  100  4R-NEXBV8V  [EXBV8V]
RN11  100  4R-NEXBV8V  [EXBV8V]
RN12  100  4R-NEXBV8V  [EXBV8V]
RN15  10k  4R-NEXBV8V  [EXBV8V]
RN16  100  4R-NEXBV8V  [EXBV8V]
RN17  100  4R-NEXBV8V  [EXBV8V]
RN18  100  4R-NEXBV8V  [EXBV8V]
RN19  100  4R-NEXBV8V  [EXBV8V]
RN20  100  4R-NEXBV8V  [EXBV8V]
RN21  33  4R-NEXBV8V  [EXBV8V]
RN22  33  4R-NEXBV8V  [EXBV8V]
RN23  100  4R-NEXBV8V  [EXBV8V]
RN24  100  4R-NEXBV8V  [EXBV8V]
RN25  100  4R-NEXBV8V  [EXBV8V]
RN26  100  4R-NEXBV8V  [EXBV8V]
RN27  100  4R-NEXBV8V  [EXBV8V]
RN28  100  4R-NEXBV8V  [EXBV8V]
RN29  100  4R-NEXBV8V  [EXBV8V]
RN30  100  4R-NEXBV8V  [EXBV8V]
RN31  100  4R-NEXBV8V  [EXBV8V]
RN32  100  4R-NEXBV8V  [EXBV8V]
RN33  100  4R-NEXBV8V  [EXBV8V]
RN34  100  4R-NEXBV8V  [EXBV8V]
RN35  1k  4R-NEXBV8V  [EXBV8V]
RN36  33  4R-NEXBV8V  [EXBV8V]
RN37  33  4R-NEXBV8V  [EXBV8V]
RN38  33  4R-NEXBV8V  [EXBV8V]
RN39  33  4R-NEXBV8V  [EXBV8V]
RN40  33  4R-NEXBV8V  [EXBV8V]
RN41  33  4R-NEXBV8V  [EXBV8V]
RN42  33  4R-NEXBV8V  [EXBV8V]
RN43  33  4R-NEXBV8V  [EXBV8V]
RN44  25  4R-NEXBV8V  [EXBV8V]
S1  TASTER_SMD  [TASTER_SMD]
S2  TASTER_SMD  [TASTER_SMD]
S3  TASTER_SMD  [TASTER_SMD]
TP3  PTR1TP06SQ  [TP06SQ]
TP4  PTR1TP06SQ  [TP06SQ]
U1  XC7A100TFTG256  [FT256]
U$1  ARIETTA  [ARIETTA]
U$4  NTD4969NT4G_N-MOS  [TO252]
U$5  ASE  [ASE]
U$6  ASE  [ASE]
U$7  NUF2221W1  [NUF2221W1]
U$8  NUF2221W1  [NUF2221W1]
U$9  MF-SMDF200  [MF-SMDF050]
U$10  MF-SMDF200  [MF-SMDF050]
U$11  NTD4969NT4G_N-MOS  [TO252]
X1  FAB64S  [FAB64S]
X2  FAB64S  [FAB64S]
X3  FAB64S  [FAB64S]
X4  FAB64S  [FAB64S]
X5  ABLS2-4.000MHZ-D4Y-T  [ABLS2-4.000MHZ-D4Y-T]
X6  USB-A003  [USB-A003]
X7  USB-A003  [USB-A003]
X8  JMP2  [JMP2]

## Nets
$N299: C225.1 C226.1 C227.2 D36.3 D36.4 D36.5(VDD) U$10.2 X6.4 X7.4
+1V1_EXT: C116.1 C152.1 L7.1 L24.P$2(OUT) PAD16.1(P) R33.2
+1V1_HUB: C194.1 C195.1 C196.1 C197.1 C198.1 C199.1 C200.1 C201.1 C202.1 C203.1 C204.1 C205.1 C206.1 C207.1 C208.1 C209.1 C210.1 C211.1 C212.1 C213.1 C214.1 C215.1 C216.1 IC9.19(VDD) IC9.25(VDD) IC9.37(VDD) IC9.45(VDD) IC9.53(VDD) IC9.60(VDD) IC9.63(VDD) L7.2
+1V8_EXT: C117.1 C149.1 D6.1 D38.1 D39.1 D40.3 L21.P$2(OUT) PAD14.1(P) R32.2 X1.B32 X2.B32 X3.B32 X4.B32
+1V8_INT: C20.1 C21.1 C22.1 C23.1 C24.1 C25.1 C26.1 C27.1 C28.1 C110.1 C148.1 L1.2 L15.P$2(OUT) PAD6.1(P) R28.2 U1.F8(B0:VCCBATT_0) U1.G10(BVCCAUX:VCCAUX) U1.J10(BVCCAUX:VCCAUX) U1.K11(BVCCAUX:VCCAUX) U1.L10(BVCCAUX:VCCAUX)
+1V_INT: C29.1 C30.1 C31.1 C32.1 C33.1 C34.1 C35.1 C36.1 C37.1 C38.1 C39.1 C40.1 C41.1 C42.1 C43.1 C109.1 C151.1 L16.P$2(OUT) PAD8.1(P) R29.2 U1.E10(BVCCBRAM:VCCBRAM) U1.F7(BVCCINT:VCCINT) U1.F9(BVCCINT:VCCINT) U1.F11(BVCCBRAM:VCCBRAM) U1.G6(BVCCINT:VCCINT) U1.H9(BVCCINT:VCCINT) U1.J6(BVCCINT:VCCINT) U1.K9(BVCCINT:VCCINT) U1.L8(BVCCINT:VCCINT)
+3V3_ARIETTA: C82.2 C83.2 C89.2 C90.2 D3.C D4.5(VDD) D5.5(VDD) D7.5(VDD) D8.5(VDD) R37.1 RN15.5 RN15.6 RN15.7 RN15.8 U$1.5(3V3)
+3V3_BLUETOOTH: C94.2 C95.2 C96.2 C97.2 C98.2 C99.2 C100.2 C101.2 C103.1 C123.2 C124.2 C125.2 C252.2 D10.5(VDD) D11.5(VDD) D12.5(VDD) IC6.4(DVDD_USB) IC6.10(DVDD2) IC6.21(AVDD5) IC6.24(AVDD3) IC6.27(AVDD2) IC6.28(AVDD1) IC6.29(AVDD4) IC6.31(AVDD6) IC6.39(DVDD1) L4.2
+3V3_EXT: C60.1 C61.1 C62.1 C63.1 C64.1 C65.1 C66.1 C69.1 C70.1 C71.1 C72.1 C73.1 C74.1 C75.1 C76.1 C77.1 C78.1 C79.1 C80.1 C81.1 C115.1 C118.1 C146.1 C159.1 C177.2 C251.1 D1.5(VDD) D2.5(VDD) D6.6 D35.5(VDD) D38.6 D39.6 D40.6 D42.4 D42.5(VDD) IC8.BIAS IC8.PVIN3 IC8.PVIN4 IC11.5(VCC) IC12.5(VCC) IC13.5(VCC) L10.1 L18.2(OUT) PAD11.1(P) R2.2 R31.2 R107.1 U1.A6(B35:VCCO_35) U1.A16(B15:VCCO_15) U1.B3(B35:VCCO_35) U1.B13(B15:VCCO_15) U1.C10(B15:VCCO_15) U1.D7(B35:VCCO_35) U1.E4(B35:VCCO_35) U1.E14(B15:VCCO_15) U1.F1(B35:VCCO_35) U1.H15(B15:VCCO_15) U1.J2(B35:VCCO_35) U1.J12(B15:VCCO_15) X1.B30 X2.B30 X3.B30 X4.B30 X8.1
+3V3_HUB: C181.1 C182.1 C183.1 C184.1 C185.1 C186.1 C187.1 C188.1 C189.1 C190.1 C191.1 C192.1 C193.1 C228.1 IC9.2(VDD33) IC9.20(VDD33) IC9.31(VDD33) IC9.48(VDD33) IC14.8(VCC) L10.2 R56.1 R57.2 R63.1 R64.2 U$7.5(VBUS) U$8.5(VBUS)
+3V3_INT: C1.1 C2.2 C3.2 C4.2 C5.1 C6.1 C7.1 C8.1 C9.1 C10.1 C11.1 C12.1 C13.1 C14.1 C15.1 C16.1 C18.1 C19.1 C51.1 C52.1 C53.1 C54.1 C55.1 C56.1 C57.1 C58.1 C59.1 C84.1 C85.1 C86.1 C87.1 C108.1 C111.1 C122.1 C131.1 C145.1 C158.1 C230.1 C231.1 C232.1 C233.1 C234.1 C235.1 C236.1 C237.1 C238.1 C239.1 C240.1 C241.1 C242.1 C243.1 C244.1 C245.1 C246.1 C247.1 C248.1 C249.1 C250.1 C270.2 D37.C D41.5(VDD) IC1.VCC IC5.18(VCC) IC7.BIAS IC7.PVIN3 IC7.PVIN4 IC10.AD0 IC10.OVDD IC16.1(VDD) IC16.3(VDDQ) IC16.9(VDDQ) IC16.14(VDD) IC16.27(VDD) IC16.43(VDDQ) IC16.49(VDDQ) K2.3 L14.2(OUT) PAD4.1(P) R3.2 R5.2 R6.2 R7.1 R9.1 R10.1 R14.1 R15.1 R27.2 R38.1 R65.2 R95.1 U1.L6(B0:VCCO_0) U1.L16(B14:VCCO_14) U1.M3(B34:VCCO_34) U1.M13(B14:VCCO_14) U1.N10(B14:VCCO_14) U1.P7(B14:VCCO_14) U1.R4(B34:VCCO_34) U1.R14(B14:VCCO_14) U1.T1(B34:VCCO_34) U1.T11(B14:VCCO_14) U$5.1(TRI) U$5.4(VDD) U$6.1(TRI) U$6.4(VDD)
+5V_EXT: C114.1 C143.1 C229.1 C266.2 C267.2 C268.2 C269.2 D6.3 D6.5(VDD) D38.3 D38.5(VDD) D39.3 D39.5(VDD) D40.1 D40.5(VDD) L17.2(OUT) PAD10.1(P) R30.2 R45.1 U$10.1 X1.B31 X2.B31 X3.B31 X4.B31
+5V_INT: C46.1 C47.1 C48.1 C49.1 C50.1 C107.1 C142.1 L13.2(OUT) PAD1.1(P) R26.2 U$1.1(5V)
ACDRVPIN: K4.2 Q1.1(G) R122.2 R124.1
ACN: C132.1 C133.1 IC10.AVCC IC10.DVCC IC10.IP_1(IP) IC10.IP_2(IP) IC10.IP_3(IP) IC10.IP_4(IP) IC10.IP_5(IP) IC10.IP_6(IP) K5.1 K5.2 K5.3 Q1.3(D) R126.2
ACPPIN: K5.4 R126.1 U$11.3(D)
ARIETTA_IO0: D4.1 RN1.8 X1.B7 X2.B7
ARIETTA_IO1: D4.3 RN1.7 X1.A6 X2.A7
ARIETTA_IO2: D4.4 RN1.6 X1.B6 X2.B6
ARIETTA_IO3: D4.6 RN1.5 X1.B5 X2.A6
ARIETTA_IO4: D5.3 RN2.5 X1.A5 X2.B5
ARIETTA_IO5: D5.1 RN2.6 X1.B4 X2.A5
AVCCPIN: D9.4(C) K4.3 Q1.2(S) R123.2 U$4.3(D)
BANK1_AD*N0: RN3.5 X3.B22
BANK1_AD*N1: RN3.8 X3.B24
BANK1_AD*N2: RN4.8 X3.A26
BANK1_AD*N3: RN5.7 X3.A21
BANK1_AD*N4: RN6.7 X3.A28
BANK1_AD*N5: RN6.5 X3.B27
BANK1_AD*N6: RN7.8 X3.A24
BANK1_AD*N7: RN7.5 X3.B26
BANK1_AD*P0: RN3.6 X3.A22
BANK1_AD*P1: RN3.7 X3.B23
BANK1_AD*P2: RN4.7 X3.A25
BANK1_AD*P3: RN5.8 X3.B21
BANK1_AD*P4: RN6.8 X3.B28
BANK1_AD*P5: RN6.6 X3.A27
BANK1_AD*P6: RN7.7 X3.A23
BANK1_AD*P7: RN7.6 X3.B25
BANK1_FAULT: IC12.2(I) R41.2 U1.E6(B35:IO_0_35)
BANK1_MRCC/SRCC0: RN8.6 X1.A25 X4.B25
BANK1_MRCC/SRCC1: RN8.5 X1.B25 X4.B24
BANK1_MRCC/SRCC2: RN8.7 X1.B26 X4.B26
BANK1_MRCC/SRCC3: RN8.8 X1.A26 X4.B27
BANK1_MRCC/SRCC4: RN9.7 X1.B22 X4.A21
BANK1_MRCC/SRCC5: RN9.8 X1.B21 X4.A20
BANK1_MRCC/SRCC6: RN9.6 X1.A22 X2.B22
BANK1_MRCC/SRCC7: RN9.5 X1.A23 X2.B23
BANK1_T0_0: RN4.5 X1.B24 X4.B23
BANK1_T0_1: RN4.6 X1.A24 X4.A23
BANK1_T0_2: RN5.6 X1.B20 X4.B20
BANK1_T0_3: RN5.5 X1.B23
BANK1_T2_0: RN10.8 X1.A21 X2.B21 X4.A17
BANK1_T2_1: RN10.7 X1.A20 X2.B20 X4.B17
BANK1_T2_2: RN10.6 X1.B19 X2.B19 X4.A14
BANK1_T2_3: RN11.7 X1.A18
BANK1_T2_4: RN10.5 X1.A19 X2.B18 X4.B14
BANK1_T2_5: RN11.8 X1.B18
BANK1_T2_6: RN11.6 X1.B17
BANK1_T2_7: RN11.5 X1.A17 X2.B17
BANK1_T3_0: RN12.8 X1.A28 X2.B28
BANK1_T3_1: RN12.7 X1.B28 X2.B27
BANK1_T3_2: RN12.6 X1.A27 X2.B26
BANK1_T3_3: RN12.5 X1.B27 X2.B25
BANK2_A0: RN30.6 X1.A15 X3.A12 X4.A10
BANK2_A1: RN30.5 X1.B14 X3.B11 X4.B9
BANK2_A2: RN31.8 X1.B12 X3.B9 X4.B7
BANK2_A3: RN31.6 X1.B13 X3.B10 X4.B8
BANK2_A4: RN31.7 X1.A12 X3.A9 X4.A7
BANK2_A5: RN31.5 X1.A13 X3.A10 X4.A8
BANK2_A6: RN32.7 X1.B11 X3.B8 X4.B6
BANK2_A7: RN32.8 X1.A11 X3.A8 X4.A6
BANK2_A8: RN32.5 X1.B9 X3.B7 X4.B5
BANK2_A9: RN32.6 X1.B10 X3.A7 X4.A5
BANK2_A10: RN33.8 X1.A14 X3.A11 X4.A9
BANK2_A11: RN33.7 X1.B15 X3.B12 X4.B10
BANK2_A12: RN33.5 X1.B16 X4.A16
BANK2_A13: RN33.6 X1.A16 X4.A15
BANK2_AD*N0: RN23.6 X3.B19
BANK2_AD*N1: RN23.5 X3.A19
BANK2_AD*N2: RN24.7 X3.B13
BANK2_AD*N3: RN25.8 X3.A15
BANK2_AD*N4: RN26.7 X3.A16
BANK2_AD*N5: RN26.8 X3.B16
BANK2_AD*N6: RN27.6 X3.B17
BANK2_AD*N7: RN27.5 X3.A17
BANK2_AD*P0: RN23.8 X3.B20
BANK2_AD*P1: RN23.7 X3.A20
BANK2_AD*P2: RN24.8 X3.A13
BANK2_AD*P3: RN25.7 X3.B15
BANK2_AD*P4: RN26.5 X3.B14
BANK2_AD*P5: RN26.6 X3.A14
BANK2_AD*P6: RN27.8 X3.B18
BANK2_AD*P7: RN27.7 X3.A18
BANK2_FAULT: IC13.2(I) R42.2 U1.D10(B15:IO_0_15)
BANK2_MRCC/SRCC0: RN28.8 X2.A10 X3.A5
BANK2_MRCC/SRCC1: RN28.7 X2.B10 X3.B5
BANK2_MRCC/SRCC2: RN28.6 X2.A8 X3.B2
BANK2_MRCC/SRCC3: RN28.5 X2.B8 X3.B1
BANK2_MRCC/SRCC4: RN29.7 X2.A9 X3.B4
BANK2_MRCC/SRCC5: RN29.8 X2.B9 X3.B3
BANK2_MRCC/SRCC6: RN29.6 X2.B11 X3.B6
BANK2_MRCC/SRCC7: RN29.5 X2.A11 X3.A6
BANK2_T0_0: RN24.6 X2.A12 X4.A11
BANK2_T0_1: RN24.5 X2.B12 X4.B11
BANK2_T0_2: RN25.5 X2.A14 X4.A13
BANK2_T0_3: RN25.6 X2.A13 X4.B13
BANK2_T2_0: RN30.7 X2.A15 X4.B15
BANK2_T2_1: RN30.8 X2.A16 X4.B16
BANK2_T3_0: RN34.7 X1.A8 X2.B14
BANK2_T3_1: RN34.8 X1.A7 X2.B13
BANK2_T3_2: RN34.6 X1.A9 X2.B15
BANK2_T3_3: RN34.5 X1.A10 X2.B16
BANK_FAULT: D35.4 R62.2 X1.B29 X2.B29 X3.B29 X4.B29
BLUETOOTH_EXT0: D11.1 RN18.8 X2.A17 X4.A18
BLUETOOTH_EXT1: D11.3 RN18.7 X2.A18 X4.B18
BLUETOOTH_EXT2: D10.6 RN18.6 X2.A22 X4.B22
BLUETOOTH_EXT3: D10.4 RN18.5 X2.A21 X4.B21
BLUETOOTH_EXT4: D10.1 RN19.8 X2.A20 X4.A19
BLUETOOTH_EXT5: D10.3 RN19.7 X2.A19 X4.B19
BLUETOOTH_EXT6: D11.6 RN19.6 X2.A23 X4.A22
BLUETOOTH_EXT7: D11.4 RN19.5 X2.A24 X4.A24
BLUETOOTH_EXT8: D12.1 RN20.8 X2.A25 X4.A25
BLUETOOTH_EXT9: D12.3 RN20.7 X2.A26 X4.A26
BLUETOOTH_EXT10: D12.6 RN20.6 X2.A27 X4.A27
BLUETOOTH_EXT11: D12.4 RN20.5 X2.A28 X4.A28
BLUETOOTH_INT0: RN21.8 U1.J1(B35:IO_L22N_T3_35)
BLUETOOTH_INT1: RN21.7 U1.K1(B35:IO_L22P_T3_35)
BLUETOOTH_INT2: RN21.6 U1.H3(B35:IO_L21N_T3_DQS_35)
BLUETOOTH_INT3: RN21.5 U1.J3(B35:IO_L21P_T3_DQS_35)
BLUETOOTH_INT4: RN22.8 U1.L2(B35:IO_L23N_T3_35)
BLUETOOTH_INT5: RN22.7 U1.L3(B35:IO_L23P_T3_35)
BLUETOOTH_INT6: RN22.6 U1.K2(B35:IO_L24N_T3_35)
BLUETOOTH_INT7: RN22.5 U1.K3(B35:IO_L24P_T3_35)
BLUETOOTH_USB_DM: C222.1 IC6.3(USB_N) R51.1
BLUETOOTH_USB_DP: C223.1 IC6.2(USB_P) R53.1 R63.2
CMSRCPIN: K4.1 R125.1
CONFIG_CCLK: IC1.SCK R24.1 U1.E8(B0:CCLK_0)
CONFIG_D00_MOSI: R12.1 U1.J13(B14:IO_L1P_T0_D00_MOSI_14)
CONFIG_D01_DIN: R11.2 R18.2 U1.J14(B14:IO_L1N_T0_D01_DIN_14)
CONFIG_D02_DQ2: R13.1 U1.K15(B14:IO_L2P_T0_D02_14)
CONFIG_D03_DQ3: R16.2 U1.K16(B14:IO_L2N_T0_D03_14)
CONFIG_DOUT: R19.2 U1.T12(B14:IO_L15N_T2_DQS_DOUT_CSO_B_14)
CONFIG_FCS_B: IC1.CS# R15.2 U1.L12(B14:IO_L6P_T0_FCS_B_14)
DONE: R7.2 R8.1 R22.1 U1.H10(B0:DONE_0)
FIFO0: IC5.24(DATA0) U1.P15(B14:IO_L8P_T1_D11_14)
FIFO1: IC5.4(DATA1) U1.M14(B14:IO_L4N_T0_D05_14)
FIFO2: IC5.2(DATA2) U1.N16(B14:IO_L7N_T1_D10_14)
FIFO3: IC5.9(DATA3) U1.L14(B14:IO_L4P_T0_D04_14)
FIFO4: IC5.1(DATA4) U1.P16(B14:IO_L8N_T1_D12_14)
FIFO5: IC5.7(DATA5) U1.K13(B14:IO_L5P_T0_D06_14)
FIFO6: IC5.8(DATA6) U1.L13(B14:IO_L5N_T0_D07_14)
FIFO7: IC5.5(DATA7) U1.M16(B14:IO_L7P_T1_D09_14)
FIFO_USB_DM: C221.1 IC5.14(USBDM) R52.1
FIFO_USB_DP: C224.1 IC5.13(USBDP) R54.1 R64.1
FPGA_CCLK1: U1.N14(B14:IO_L12P_T1_MRCC_14) U$5.3(OUT)
FPGA_CCLK2: U1.P14(B14:IO_L12N_T1_MRCC_14) U$6.3(OUT)
GND: C1.2 C2.1 C3.1 C4.1 C5.2 C6.2 C7.2 C8.2 C9.2 C10.2 C11.2 C12.2 C13.2 C14.2 C15.2 C16.2 C17.2 C18.2 C19.2 C20.2 C21.2 C22.2 C23.2 C24.2 C25.2 C26.2 C27.2 C28.2 C29.2 C30.2 C31.2 C32.2 C33.2 C34.2 C35.2 C36.2 C37.2 C38.2 C39.2 C40.2 C41.2 C42.2 C43.2 C44.2 C46.2 C47.2 C48.2 C49.2 C50.2 C51.2 C52.2 C53.2 C54.2 C55.2 C56.2 C57.2 C58.2 C59.2 C60.2 C61.2 C62.2 C63.2 C64.2 C65.2 C66.2 C67.2 C68.2 C69.2 C70.2 C71.2 C72.2 C73.2 C74.2 C75.2 C76.2 C77.2 C78.2 C79.2 C80.2 C81.2 C82.1 C83.1 C84.2 C85.2 C86.2 C87.2 C88.1 C89.1 C90.1 C91.1 C92.1 C93.1 C94.1 C95.1 C96.1 C97.1 C98.1 C99.1 C100.1 C101.1 C102.2 C103.2 C105.2 C106.2 C111.2 C112.2 C113.2 C118.2 C121.2 C122.2 C123.1 C124.1 C125.1 C126.1 C127.1 C129.2 C130.2 C131.2 C132.2 C133.2 C135.2 C142.2 C143.2 C145.2 C146.2 C148.2 C149.2 C151.2 C152.2 C154.2 C156.2 C157.2 C158.2 C159.2 C160.2 C161.2 C177.1 C178.1 C179.1 C180.1 C181.2 C182.2 C183.2 C184.2 C185.2 C186.2 C187.2 C188.2 C189.2 C190.2 C191.2 C192.2 C193.2 C194.2 C195.2 C196.2 C197.2 C198.2 C199.2 C200.2 C201.2 C202.2 C203.2 C204.2 C205.2 C206.2 C207.2 C208.2 C209.2 C210.2 C211.2 C212.2 C213.2 C214.2 C215.2 C216.2 C217.1 C218.2 C219.1 C220.2 C221.2 C222.2 C223.2 C224.2 C225.2 C226.2 C227.1 C228.2 C229.2 C230.2 C231.2 C232.2 C233.2 C234.2 C235.2 C236.2 C237.2 C238.2 C239.2 C240.2 C241.2 C242.2 C243.2 C244.2 C245.2 C246.2 C247.2 C248.2 C249.2 C250.2 C251.2 C252.1 C266.1 C267.1 C268.1 C269.1 C270.1 D1.2(GND) D2.2(GND) D4.2(GND) D5.2(GND) D6.2(GND) D7.2(GND) D8.2(GND) D10.2(GND) D11.2(GND) D12.2(GND) D35.2(GND) D36.2(GND) D38.2(GND) D39.2(GND) D40.2(GND) D41.2(GND) D42.2(GND) G1.- IC1.GND IC5.6(GND) IC5.19(GND1) IC6.1(DGND_USB) IC6.EXP@1(EXP:EXP16) IC6.EXP@2(EXP:EXP16) IC6.EXP@3(EXP:EXP16) IC6.EXP@4(EXP:EXP16) IC6.EXP@5(EXP:EXP16) IC6.EXP@6(EXP:EXP16) IC6.EXP@7(EXP:EXP16) IC6.EXP@8(EXP:EXP16) IC6.EXP@9(EXP:EXP16) IC6.EXP@10(EXP:EXP16) IC6.EXP@11(EXP:EXP16) IC6.EXP@12(EXP:EXP16) IC6.EXP@13(EXP:EXP16) IC6.EXP@14(EXP:EXP16) IC6.EXP@15(EXP:EXP16) IC6.EXP@16(EXP:EXP16) IC7.GND_1(GND) IC7.GND_2(GND) IC7.GND_3(GND) IC7.GND_4(GND) IC7.GND_5(GND) IC7.GND_6(GND) IC7.GND_7(GND) IC7.GND_8(GND) IC7.POREN IC7.SYNC IC8.GND_1(GND) IC8.GND_2(GND) IC8.GND_3(GND) IC8.GND_4(GND) IC8.GND_5(GND) IC8.GND_6(GND) IC8.GND_7(GND) IC8.GND_8(GND) IC8.POREN IC8.SYNC IC9.EXP(GND) IC10.AGND IC10.ALERT IC10.DGND IC10.DGND_2(DGND) IC10.GPIO IC11.3(GND) IC12.3(GND) IC13.3(GND) IC14.4(GND) IC16.6(VSSQ) IC16.12(VSSQ) IC16.28(VSS) IC16.41(VSS) IC16.46(VSSQ) IC16.52(VSSQ) IC16.54(VSS) K1.1 K1.12 K2.1 K3.1 K4.4 K4.5 L2.2 L6.1 LED_BANK1_FAULT.C@1(C) LED_BANK1_ONLINE.C@1(C) LED_BANK2_FAULT.C@1(C) LED_BANK2_ONLINE.C@1(C) LED_BLUETOOTH.C@1(C) LED_DONE.C@1(C) R4.2 R39.2 R44.1 R46.1 R84.1 R86.1 R88.1 R90.1 R92.1 R94.1 R96.1 R98.1 R100.1 R102.1 R104.1 R106.1 R121.2 R122.1 RN35.5 RN35.6 RN35.7 RN35.8 S1.1(S) S1.2(S1) S2.3(P) S2.4(P1) S3.3(P) S3.4(P1) U1.A1(BGND:GND) U1.A11(BGND:GND) U1.B8(BGND:GND) U1.C5(BGND:GND) U1.C15(BGND:GND) U1.D2(BGND:GND) U1.D12(BGND:GND) U1.E9(BGND:GND) U1.F6(BGND:GND) U1.F10(BGND:GND) U1.F16(BGND:GND) U1.G3(BGND:GND) U1.G9(BGND:GND) U1.G13(BGND:GND) U1.H6(BGND:GND) U1.J9(BGND:GND) U1.J11(BGND:GND) U1.K4(BGND:GND) U1.K6(BGND:GND) U1.K7(BTDIODE:DXN_0) U1.K8(BTDIODE:DXP_0) U1.K14(BGND:GND) U1.L1(BGND:GND) U1.L11(BGND:GND) U1.M8(BGND:GND) U1.N5(BGND:GND) U1.N15(BGND:GND) U1.P2(BGND:GND) U1.P12(BGND:GND) U1.R9(BGND:GND) U1.T6(BGND:GND) U1.T16(BGND:GND) U$1.9(GND) U$1.D6(DEBUG_GND) U$5.2(GND) U$6.2(GND) U$7.2(GND) U$8.2(GND) X1.A29 X1.A30 X1.A31 X1.A32 X2.A29 X2.A30 X2.A31 X2.A32 X3.A29 X3.A30 X3.A31 X3.A32 X4.A29 X4.A30 X4.A31 X4.A32 X6.1 X7.1 ; supply symbol labelled AGND
I2C_SCL0: RN2.1 RN15.4 U1.M12(B14:IO_L6N_T0_D08_VREF_14) U$1.12(I2C_SCL0/SPI_CS2)
I2C_SCL1: RN15.3 RN17.6 U1.N12(B14:IO_L13N_T2_MRCC_14) U$1.37(I2C_SCL1)
I2C_SDA0: RN2.2 RN15.1 U1.N13(B14:IO_L11P_T1_SRCC_14) U$1.14(I2C_SDA0/SPI_CS3)
I2C_SDA1: RN15.2 RN17.5 U1.T14(B14:IO_L10P_T1_D14_14) U$1.39(I2C_SDA1)
INIT_B: R10.2 R23.1 U1.K10(B0:INIT_B_0)
JTAG_RXD: D2.3 K1.11 R25.1
JTAG_TXD: D2.4 K1.9 U$1.D4(DEBUG_RXD)
N$1: D1.6 K1.2 U1.L7(B0:TCK_0)
N$2: R1.1 U1.N8(B0:TDO_0)
N$3: D1.4 K1.4 R1.2
N$4: D1.3 K1.5 U1.N7(B0:TDI_0)
N$5: D1.1 K1.6 U1.M7(B0:TMS_0)
N$6: K1.3 R2.1
N$7: R3.1 U1.E7(B0:CFGBVS_0)
N$9: IC1.SO/PO7(SO/DQ1) R11.1
N$10: R17.2 U$1.29(PC28)
N$11: D41.6 K2.4 R4.1 U1.M10(B0:M1_0)
N$12: D41.4 K2.2 R5.1 U1.M11(B0:M2_0)
N$13: LED_DONE.A@1(A) R8.2
N$14: C44.1 C45.1 L1.1 U1.G8(BXADC:VCCADC_0)
N$15: R25.2 U$1.D3(DEBUG_TXD)
N$16: R14.2 U1.L15(B14:IO_L3P_T0_DQS_PUDC_B_14)
N$17: K3.2 U$9.1
N$18: IC1.SI(SI/DQ0) R12.2
N$19: IC1.HOLD#(HLD#/DQ3) R16.1
N$20: IC1.WP#ACC(WP#/DQ2) R13.2
N$21: C178.2 IC9.30(XI) Q2.1 R43.1
N$22: RN1.1 U$1.21(PA29/I2S(RF))
N$23: RN1.2 U$1.19(PA28/I2S(RK))
N$25: RN1.3 U$1.17(PA27/I2S(RD))
N$26: IC16.38(CLK) R20.2
N$27: RN1.4 U$1.15(PA26/I2S(TD))
N$28: R58.1 R61.1 U$1.D2(DEBUG_EN5V)
N$29: C17.1 IC5.3(VCCIO) IC5.15(3V3OUT) IC5.16(RESET#)
N$30: IC5.23(CBUS5) U1.M1(B34:IO_L2N_T0_34)
N$32: IC16.15(DQML) RN36.4
N$34: C107.2 IC7.FB1 R87.1 R88.2
N$35: PAD2.1(P) R26.1 R87.2
N$36: R22.2 U$1.35(PC2)
N$37: R23.2 U$1.32(PC31)
N$38: R24.2 U$1.30(PC27)
N$39: R18.1 U$1.26(PA7)
N$40: R19.1 U$1.24(PA1)
N$41: IC11.4(O) R62.1
N$42: R35.2 U1.G11(B15:IO_25_15)
N$43: PAD3.1(P) R27.1 R89.2
N$44: PAD5.1(P) R28.1 R93.2
N$45: PAD7.1(P) R29.1 R91.2
N$46: IC7.SW4 L16.P$1(IN)
N$47: PAD9.1(P) R30.1 R99.2
N$48: PAD12.1(P) R31.1 R101.2
N$49: PAD13.1(P) R32.1 R105.2
N$50: IC8.SW4 L24.P$1(IN)
N$51: PAD15.1(P) R33.1 R103.2
N$52: R36.1 U$1.2(VBAT)
N$53: IC5.21(RXF#) U1.M4(B34:IO_L1N_T0_34)
N$54: IC5.20(TXE#) U1.M2(B34:IO_L2P_T0_34)
N$55: IC5.11(RD#) U1.L5(B34:IO_0_34)
N$56: IC5.12(WR#) U1.L4(B34:IO_L1P_T0_34)
N$58: RN2.4 U$1.13(PA25/I2S(TF))
N$59: RN2.3 U$1.11(PA24/I2S(TK))
N$60: R61.2 U$1.D1(DEBUG_3V3)
N$61: RN10.4 U1.G2(B35:IO_L17P_T2_35)
N$62: RN11.1 U1.G1(B35:IO_L17N_T2_35)
N$63: IC11.2(I1) IC13.4(O)
N$64: IC11.1(I0) IC12.4(O)
N$65: C179.2 IC9.29(XO) Q2.3 R43.2
N$66: IC9.22(USB_DM_UP) U$1.4(USBA_D-)
N$68: C180.2 IC9.18(GRSTZ)
N$69: IC9.21(USB_DP_UP) U$1.6(USBA_D+)
N$71: RN11.2 U1.G4(B35:IO_L16N_T2_35)
N$72: RN12.4 U1.H1(B35:IO_L20N_T3_35)
N$73: RN12.3 U1.H2(B35:IO_L20P_T3_35)
N$74: RN12.2 U1.J4(B35:IO_L19N_T3_VREF_35)
N$75: RN12.1 U1.J5(B35:IO_L19P_T3_35)
N$76: RN11.4 U1.H4(B35:IO_L18N_T2_35)
N$77: RN11.3 U1.H5(B35:IO_L18P_T2_35)
N$78: R125.2 U$4.2(S) U$11.2(S)
N$79: RN8.3 U1.E3(B35:IO_L11P_T1_SRCC_35)
N$80: RN8.1 U1.C4(B35:IO_L12N_T1_MRCC_35)
N$81: RN8.4 U1.D3(B35:IO_L11N_T1_SRCC_35)
N$82: RN10.3 U1.G5(B35:IO_L16P_T2_35)
N$83: RN10.2 U1.E1(B35:IO_L15N_T2_DQS_35)
N$84: RN10.1 U1.F2(B35:IO_L15P_T2_DQS_35)
N$85: RN9.4 U1.F3(B35:IO_L14N_T2_SRCC_35)
N$86: RN9.3 U1.F4(B35:IO_L14P_T2_SRCC_35)
N$87: RN9.1 U1.E5(B35:IO_L13N_T2_MRCC_35)
N$88: RN9.2 U1.F5(B35:IO_L13P_T2_MRCC_35)
N$89: RN8.2 U1.D4(B35:IO_L12P_T1_MRCC_35)
N$90: RN7.1 U1.B1(B35:IO_L9N_T1_DQS_AD7N_35)
N$91: RN7.2 U1.C1(B35:IO_L9P_T1_DQS_AD7P_35)
N$92: RN4.1 U1.A4(B35:IO_L3N_T0_DQS_AD5N_35)
N$93: RN7.4 U1.D1(B35:IO_L10N_T1_AD15N_35)
N$94: RN7.3 U1.E2(B35:IO_L10P_T1_AD15P_35)
N$95: RN4.2 U1.A5(B35:IO_L3P_T0_DQS_AD5P_35)
N$96: RN4.3 U1.A3(B35:IO_L4N_T0_35)
N$97: RN6.4 U1.A2(B35:IO_L8N_T1_AD14N_35)
N$98: RN6.3 U1.B2(B35:IO_L8P_T1_AD14P_35)
N$99: RN6.2 U1.C2(B35:IO_L7N_T1_AD6N_35)
N$100: RN6.1 U1.C3(B35:IO_L7P_T1_AD6P_35)
N$101: RN5.4 U1.D5(B35:IO_L6N_T0_VREF_35)
N$102: RN5.3 U1.D6(B35:IO_L6P_T0_35)
N$103: RN5.2 U1.C6(B35:IO_L5N_T0_AD13N_35)
N$104: RN5.1 U1.C7(B35:IO_L5P_T0_AD13P_35)
N$105: RN4.4 U1.B4(B35:IO_L4P_T0_35)
N$106: RN3.3 U1.B7(B35:IO_L1P_T0_AD4P_35)
N$107: RN3.1 U1.B5(B35:IO_L2N_T0_AD12N_35)
N$108: RN3.4 U1.A7(B35:IO_L1N_T0_AD4N_35)
N$109: RN3.2 U1.B6(B35:IO_L2P_T0_AD12P_35)
N$110: RN25.3 U1.D9(B15:IO_L6N_T0_VREF_15)
N$111: RN25.4 U1.D8(B15:IO_L6P_T0_15)
N$112: IC9.32(USB_R1) R44.2
N$113: R34.2 U1.K5(B35:IO_25_35)
N$114: LED_BANK1_ONLINE.A@1(A) R34.1
N$115: C219.2 R48.1 U$7.3(D2(I-))
N$116: IC7.EN/UVLO R85.1 R86.2
N$117: C106.1 IC7.TRKSS2
N$118: C105.1 IC7.TRKSS1
N$119: IC7.RT R84.2
N$120: C156.1 IC7.INTVCC
N$121: C108.2 IC7.FB2 R89.1 R90.2
N$122: IC9.16(USB_VBUS) R45.2 R46.2
N$123: C109.2 IC7.FB4 R91.1 R92.2
N$124: C110.2 IC7.FB3 R93.1 R94.2
N$125: IC7.PG2 IC7.RUN3 IC7.RUN4 R95.2
N$126: IC8.EN/UVLO R97.1 R98.2
N$127: C113.1 IC8.TRKSS2
N$128: C112.1 IC8.TRKSS1
N$129: IC8.RT R96.2
N$130: C154.1 IC8.INTVCC
N$131: C115.2 IC8.FB2 R101.1 R102.2
N$132: C114.2 IC8.FB1 R99.1 R100.2
N$133: C116.2 IC8.FB4 R103.1 R104.2
N$134: C117.2 IC8.FB3 R105.1 R106.2
N$135: IC8.PG2 IC8.RUN3 IC8.RUN4 R107.2
N$136: C220.1 R49.1 U$7.1(D1(I+))
N$137: C217.2 R47.1 U$8.3(D2(I-))
N$138: IC6.37(P1_7) RN21.2
N$139: S3.2(S1)
N$140: C119.1 IC6.26(RF_N) TP3.TP
N$141: C104.1 IC6.25(RF_P) TP4.TP
N$142: C138.2 IC8.SW1 L17.1(IN)
N$143: C93.2 IC6.23(XOSC_Q2) Q3.3
N$144: C92.2 IC6.22(XOSC_Q1) Q3.1
N$145: U1.N3(B34:IO_L3P_T0_DQS_34) U$1.28(UART_TXD)
N$146: U1.N2(B34:IO_L3N_T0_DQS_34) U$1.27(UART_RXD)
N$147: IC7.SW3 L15.P$1(IN)
N$148: G1.+@1(+) G1.+@2(+) R36.2
N$149: IC8.SW3 L21.P$1(IN)
N$150: S2.2(S1)
N$151: IC6.30(RBIAS) L3.2
N$152: L3.1 R39.1
N$153: C129.1 IC10.CKLI(CLKI) X5.1
N$154: C130.1 IC10.CLKO X5.2
N$155: C126.2 C128.1 IC10.CFP
N$156: C127.2 C128.2 IC10.CFM
N$157: C135.1 IC10.BYP
N$158: C134.1 IC10.VP R120.1
N$159: C134.2 IC10.VM R121.1
N$160: IC6.6(P1_4) RN21.4
N$161: C102.1 IC6.40(DCOUPL)
N$162: C136.1 IC7.BST1
N$163: C137.1 IC7.BST2
N$164: C138.1 IC8.BST1
N$165: C139.1 IC8.BST2
N$166: C104.2 C121.1 L5.2 L8.2
N$167: C119.2 C120.1 L6.2 L8.1
N$168: C157.1 R123.1
N$169: R124.2 U$4.1(G) U$11.1(G)
N$170: C218.1 R50.1 U$8.1(D1(I+))
N$172: C136.2 IC7.SW1 L13.1(IN)
N$173: C137.2 IC7.SW2 IC7.SW2_2(SW2) L14.1(IN)
N$174: C139.2 IC8.SW2 IC8.SW2_2(SW2) L18.1(IN)
N$175: D41.1 R6.1 U1.M9(B0:M0_0)
N$176: ANT1.1(ANTENNA) C120.2 L5.1
N$177: IC16.7(DQ3) RN40.1
N$178: IC16.2(DQ0) RN40.4
N$179: IC6.11(P1_0) RN20.1
N$180: IC6.12(P0_7) RN19.4
N$181: IC6.13(P0_6) RN19.3
N$182: IC6.14(P0_5) RN19.2
N$183: IC6.15(P0_4) RN19.1
N$184: IC6.16(P0_3) RN18.4
N$185: IC6.17(P0_2) RN18.3
N$186: IC6.18(P0_1) RN18.2
N$187: IC6.19(P0_0) RN18.1
N$188: IC6.9(P1_1) RN20.2
N$189: IC6.8(P1_2) RN20.3
N$190: IC6.7(P1_3) RN20.4
N$191: IC16.39(DQMH) RN36.3
N$192: LED_BANK2_ONLINE.A@1(A) R35.1
N$193: IC6.5(P1_5) RN21.3
N$194: IC9.34(USB_DM_DN1) R47.2
N$195: IC6.36(P2_0) RN22.1
N$196: IC6.35(P2_1) RN22.2
N$197: IC6.34(P2_2) RN22.3
N$198: IC6.33(P2_3/XOSC32K_Q2) RN22.4
N$199: IC6.32(P2_4/XOSC32K_Q1) R40.2
N$200: RN23.3 U1.C9(B15:IO_L1N_T0_AD0N_15)
N$201: LED_BLUETOOTH.A@1(A) R40.1
N$202: LED_BANK2_FAULT.A@1(A) R42.1
N$205: IC9.42(USB_DM_DN2) R48.2
N$206: RN23.1 U1.C8(B15:IO_L1P_T0_AD0P_15)
N$207: RN23.2 U1.A8(B15:IO_L2P_T0_AD8P_15)
N$208: RN32.2 U1.H11(B15:IO_L19P_T3_A22_15)
N$209: IC9.50(USB_DM_DN3) R51.2
N$210: RN23.4 U1.A9(B15:IO_L2N_T0_AD8N_15)
N$211: IC9.41(USB_DP_DN2) R49.2
N$212: IC9.33(USB_DP_DN1) R50.2
N$213: IC9.57(USB_DM_DN4) R52.2
N$215: IC9.49(USB_DP_DN3) R53.2
N$216: IC9.56(USB_DP_DN4) R54.2
N$220: IC14.1(A0) RN35.1
N$221: RN32.4 U1.H12(B15:IO_L20P_T3_A20_15)
N$222: IC14.2(A1) RN35.2
N$223: IC14.3(A2) RN35.3
N$224: IC14.7(WP) RN35.4
N$225: IC9.6(SCL/SMBCLK) IC14.6(SCL)
N$226: IC9.5(SDA/SMBDAT) IC14.5(SDA)
N$227: IC9.7(SMBUSZ) R56.2
N$228: IC9.13(AUTOENZ/HS_SUSPEND) R57.1
N$229: R58.2 U$1.D5(DEBUG_WKUP)
N$230: D9.1(A) U$9.2
N$231: RN32.1 U1.G12(B15:IO_L19N_T3_A21_VREF_15)
N$232: IC16.16(!WE) RN44.1
N$233: IC16.17(!CAS) RN44.2
N$234: IC16.18(!RAS) RN44.3
N$235: RN36.5 U1.R16(B14:IO_L9N_T1_DQS_D13_14)
N$236: RN36.6 U1.T15(B14:IO_L10N_T1_D15_14)
N$238: RN36.8 U1.R12(B14:IO_L15P_T2_DQS_RDWR_B_14)
N$241: LED_BANK1_FAULT.A@1(A) R41.1
N$242: RN36.7 U1.P13(B14:IO_L11N_T1_SRCC_14)
N$245: IC16.20(BA0) RN36.2
N$246: IC16.21(BA1) RN36.1
N$247: IC16.23(A0) RN37.1
N$248: IC16.24(A1) RN37.2
N$249: IC16.25(A2) RN37.3
N$250: IC16.26(A3) RN37.4
N$251: IC16.22(A10) RN39.1
N$252: IC16.32(A7) RN38.1
N$253: IC16.31(A6) RN38.2
N$254: IC16.30(A5) RN38.3
N$255: IC16.29(A4) RN38.4
N$256: IC16.35(A11) RN39.4
N$257: RN24.1 U1.B9(B15:IO_L3P_T0_DQS_AD1P_15)
N$258: RN24.2 U1.A10(B15:IO_L3N_T0_DQS_AD1N_15)
N$259: RN24.3 U1.B10(B15:IO_L4P_T0_15)
N$260: RN24.4 U1.B11(B15:IO_L4N_T0_15)
N$261: RN25.2 U1.B12(B15:IO_L5P_T0_AD9P_15)
N$262: RN25.1 U1.A12(B15:IO_L5N_T0_AD9N_15)
N$263: RN32.3 U1.H13(B15:IO_L20N_T3_A19_15)
N$264: RN29.2 U1.E12(B15:IO_L13P_T2_MRCC_15)
N$265: RN26.4 U1.A13(B15:IO_L7P_T1_AD2P_15)
N$266: RN26.2 U1.A14(B15:IO_L7N_T1_AD2N_15)
N$267: RN26.3 U1.C14(B15:IO_L8P_T1_AD10P_15)
N$268: RN26.1 U1.B14(B15:IO_L8N_T1_AD10N_15)
N$269: RN27.1 U1.B15(B15:IO_L9P_T1_DQS_AD3P_15)
N$270: RN27.2 U1.C16(B15:IO_L10P_T1_AD11P_15)
N$271: RN27.3 U1.A15(B15:IO_L9N_T1_DQS_AD3N_15)
N$272: RN27.4 U1.B16(B15:IO_L10N_T1_AD11N_15)
N$273: RN28.1 U1.C11(B15:IO_L11P_T1_SRCC_15)
N$274: RN28.2 U1.C12(B15:IO_L11N_T1_SRCC_15)
N$275: RN28.3 U1.D13(B15:IO_L12P_T1_MRCC_15)
N$276: RN28.4 U1.C13(B15:IO_L12N_T1_MRCC_15)
N$277: RN29.1 U1.E13(B15:IO_L13N_T2_MRCC_15)
N$278: RN34.2 U1.J15(B15:IO_L23P_T3_FOE_B_15)
N$279: RN29.3 U1.E11(B15:IO_L14P_T2_SRCC_15)
N$280: RN29.4 U1.D11(B15:IO_L14N_T2_SRCC_15)
N$281: RN30.2 U1.D14(B15:IO_L15P_T2_DQS_15)
N$282: RN30.1 U1.D15(B15:IO_L15N_T2_DQS_ADV_B_15)
N$283: RN30.3 U1.F12(B15:IO_L16P_T2_A28_15)
N$284: RN30.4 U1.F13(B15:IO_L16N_T2_A27_15)
N$285: RN31.1 U1.E16(B15:IO_L17P_T2_A26_15)
N$286: RN31.3 U1.D16(B15:IO_L17N_T2_A25_15)
N$287: RN31.2 U1.F15(B15:IO_L18P_T2_A24_15)
N$288: RN31.4 U1.E15(B15:IO_L18N_T2_A23_15)
N$289: RN34.1 U1.J16(B15:IO_L23N_T3_FWE_B_15)
N$290: RN33.3 U1.G16(B15:IO_L22N_T3_A16_15)
N$291: RN33.4 U1.H16(B15:IO_L22P_T3_A17_15)
N$292: IC6.38(P1_6) RN21.1
N$293: RN33.1 U1.G14(B15:IO_L21P_T3_DQS_15)
N$294: RN33.2 U1.F14(B15:IO_L21N_T3_DQS_A18_15)
N$299: RN34.3 U1.H14(B15:IO_L24P_T3_RS1_15)
N$300: RN34.4 U1.G15(B15:IO_L24N_T3_RS0_15)
N$301: IC16.34(A9) RN39.3
N$302: IC16.33(A8) RN39.2
N$303: IC16.36(A12) R21.2
N$304: IC16.19(\CS) R65.1 RN44.4
N$305: IC16.37(CKE) R55.2
N$306: IC16.53(DQ15) RN43.1
N$307: IC16.51(DQ14) RN43.2
N$308: IC16.50(DQ13) RN43.3
N$309: IC16.48(DQ12) RN43.4
N$310: IC16.47(DQ11) RN42.1
N$311: IC16.45(DQ10) RN42.2
N$312: IC16.44(DQ9) RN42.3
N$313: IC16.42(DQ8) RN42.4
N$314: IC16.13(DQ7) RN41.1
N$315: IC16.11(DQ6) RN41.2
N$316: IC16.10(DQ5) RN41.3
N$317: IC16.8(DQ4) RN41.4
N$318: IC16.5(DQ2) RN40.2
N$319: IC16.4(DQ1) RN40.3
N$322: RN44.6 U1.P6(B14:IO_25_14)
N$323: RN44.5 U1.T7(B14:IO_L21P_T3_DQS_14)
N$324: RN44.8 U1.R13(B14:IO_L16P_T2_CSI_B_14)
N$325: D42.3 L4.1 X8.2
PROGRAM_B: R9.2 R17.1 S1.3(P) S1.4(P1) U1.L9(B0:PROGRAM_B_0)
PROGRAM_B1: C88.2 D3.A R37.2 S2.1(S) U$1.3(NRST)
PROGRAM_B2: C91.2 D37.A IC6.20(RESET_N) R38.2 S3.1(S)
RAM_ADDRESS0: RN37.8 U1.P4(B34:IO_L5P_T0_34)
RAM_ADDRESS1: RN37.7 U1.N1(B34:IO_L4P_T0_34)
RAM_ADDRESS2: RN37.6 U1.P3(B34:IO_L5N_T0_34)
RAM_ADDRESS3: RN37.5 U1.T4(B34:IO_L9P_T1_DQS_34)
RAM_ADDRESS4: RN38.5 U1.T2(B34:IO_L8N_T1_34)
RAM_ADDRESS5: RN38.6 U1.R1(B34:IO_L7N_T1_34)
RAM_ADDRESS6: RN38.7 U1.R2(B34:IO_L7P_T1_34)
RAM_ADDRESS7: RN38.8 U1.N4(B34:IO_L6N_T0_VREF_34)
RAM_ADDRESS8: RN39.7 U1.T3(B34:IO_L9N_T1_DQS_34)
RAM_ADDRESS9: RN39.6 U1.P1(B34:IO_L4N_T0_34)
RAM_ADDRESS10: RN39.8 U1.R3(B34:IO_L8P_T1_34)
RAM_ADDRESS11: RN39.5 U1.P5(B34:IO_L10P_T1_34)
RAM_ADDRESS12: R21.1 U1.M5(B34:IO_L6P_T0_34)
RAM_CCLK: R20.1 U1.P10(B14:IO_L14P_T2_SRCC_14)
RAM_CKE: R55.1 U1.P11(B14:IO_L14N_T2_SRCC_14)
RAM_CS: RN44.7 U1.K12(B14:IO_0_14)
RAM_DATA0: RN40.8 U1.T13(B14:IO_L16N_T2_A15_D31_14)
RAM_DATA1: RN40.7 U1.R11(B14:IO_L17N_T2_A13_D29_14)
RAM_DATA2: RN40.6 U1.R10(B14:IO_L17P_T2_A14_D30_14)
RAM_DATA3: RN40.5 U1.N9(B14:IO_L18P_T2_A12_D28_14)
RAM_DATA4: RN41.5 U1.T10(B14:IO_L22N_T3_A04_D20_14)
RAM_DATA5: RN41.6 U1.P9(B14:IO_L18N_T2_A11_D27_14)
RAM_DATA6: RN41.7 U1.T9(B14:IO_L22P_T3_A05_D21_14)
RAM_DATA7: RN41.8 U1.R8(B14:IO_L20N_T3_A07_D23_14)
RAM_DATA8: RN42.5 U1.T8(B14:IO_L21N_T3_DQS_A06_D22_14)
RAM_DATA9: RN42.6 U1.P8(B14:IO_L20P_T3_A08_D24_14)
RAM_DATA10: RN42.7 U1.R7(B14:IO_L24N_T3_A00_D16_14)
RAM_DATA11: RN42.8 U1.R6(B14:IO_L24P_T3_A01_D17_14)
RAM_DATA12: RN43.5 U1.T5(B14:IO_L23N_T3_A02_D18_14)
RAM_DATA13: RN43.6 U1.R5(B14:IO_L23P_T3_A03_D19_14)
RAM_DATA14: RN43.7 U1.N6(B14:IO_L19N_T3_A09_D25_VREF_14)
RAM_DATA15: RN43.8 U1.M6(B14:IO_L19P_T3_A10_D26_14)
SLOT_I2C_SCL1: D8.4 RN17.3 X1.A1 X2.B1 X3.A1 X4.B1
SLOT_I2C_SDA1: D8.3 RN17.4 X1.A2 X2.B2 X3.A2 X4.B2
SLOT_SPI_CLK: D7.6 RN16.7 X1.B1 X2.A1 X4.A1
SLOT_SPI_CS3: D5.4 RN2.8 X1.A3 X2.A4
SLOT_SPI_CS4: D5.6 RN2.7 X1.A4 X4.A4
SLOT_SPI_MISO: D7.3 RN16.5 X1.B3 X2.A3 X4.A3
SLOT_SPI_MOSI: D7.1 RN16.6 X1.B2 X2.A2 X4.A2
SPI_CLK: IC10.SCL RN16.2 U1.N11(B14:IO_L13P_T2_MRCC_14) U$1.7(SPI_CLK)
SPI_CS1(LT2947): IC10.AD1/CS U$1.23(SPI_CS1)
SPI_MISO: IC10.SDO RN16.4 U1.M15(B14:IO_L3N_T0_DQS_EMCCLK_14) U$1.10(SPI_MISO)
SPI_MOSI: IC10.SDI RN16.3 U1.R15(B14:IO_L9P_T1_DQS_14) U$1.8(SPI_MOSI)
USB_PORT3_DM: U$8.4(D2(C)) X2.B4 X3.A4 X4.B4 X7.2
USB_PORT3_DP: U$8.6(D1(C)) X2.B3 X3.A3 X4.B3 X7.3
USB_PORT4_DM: U$7.4(D2(C)) X6.2
USB_PORT4_DP: U$7.6(D1(C)) X6.3
VIN: C67.1 C68.1 C160.1 C161.1 IC7.PVIN1 IC7.PVIN2 IC7.VIN IC8.PVIN1 IC8.PVIN2 IC8.VIN IC10.IM_1(IM) IC10.IM_2(IM) IC10.IM_3(IM) IC10.IM_4(IM) IC10.IM_5(IM) IC10.IM_6(IM) R85.2 R97.2 R120.2
XADC_GND: C45.2 L2.1 U1.G7(BXADC:GNDADC_0) U1.H7(BXADC:VREFN_0) U1.H8(BXADC:VP_0) U1.J7(BXADC:VN_0) U1.J8(BXADC:VREFP_0)
Unconnected: D6.4 D7.4 D35.3 D38.4 D39.4 D40.4 D41.3 IC1.NC IC1.PO0 IC1.PO1 IC1.PO2 IC1.PO3 IC1.PO4 IC1.PO5 IC1.PO6 IC5.10(SI/WU#) IC5.17(VCORE) IC5.22(CBUS6) IC7.CPOR IC7.NC IC7.PG1 IC7.PG3 IC7.PG4 IC7.RST IC8.CPOR IC8.NC IC8.PG1 IC8.PG3 IC8.PG4 IC8.RST IC9.1(PWRCTL3/BATEN3) IC9.3(PWRCTL2/BATEN2) IC9.4(PWRCTL1/BATEN1) IC9.8(FULLPWRMGMTZ/SMBA1) IC9.9(PWRCTL_POL) IC9.10(GANGED/SMBA2/HS_UP) IC9.11(OVERCUR4Z) IC9.12(OVERCUR3Z) IC9.14(OVERCUR1Z) IC9.15(OVERCUR2Z) IC9.17(TEST) IC9.23(RSVD) IC9.24(RSVD) IC9.26(RSVD) IC9.27(RSVD) IC9.28(NC) IC9.35(RSVD) IC9.36(RSVD) IC9.38(RSVD) IC9.39(RSVD) IC9.40(NC) IC9.43(RSVD) IC9.44(RSVD) IC9.46(RSVD) IC9.47(RSVD) IC9.51(RSVD) IC9.52(RSVD) IC9.54(RSVD) IC9.55(RSVD) IC9.58(RSVD) IC9.59(RSVD) IC9.61(RSVD) IC9.62(RSVD) IC9.64(PWRCTL4/BATEN4) IC10.DNC IC16.40(NC) K1.7 K1.8 K1.10 K5.5 RN16.1 RN16.8 RN17.1 RN17.2 RN17.7 RN17.8 U$1.16(USBB_D+) U$1.18(USBB_D-) U$1.20(DISP_USBC_D-) U$1.22(DISP_USBC_D+) U$1.25(SPI_CS0(DISP)) U$1.31(DISP_D/CX) U$1.33(DISP_RSET) U$1.34(DISP_Y-) U$1.36(DISP_Y+) U$1.38(DISP_X+) U$1.40(DISP_X-) U$1.98(GND) U$1.99(GND) U$1.P$3(GND) U$1.W1(TX) U$1.W2(3V3) U$1.W3(D-) U$1.W4(D+) U$1.W5(GND) U$1.W6(LED) U$1.W7(WPS) X1.B8 X2.B24 X4.A12 X4.B12 X4.B28

## Buses
RAM_ADDRESS[0..12]
RAM_DATA[0..15]
FIFO[0..7]
BLUETOOTH_EXT[0..11]
BLUETOOTH_INT[0..7]
BANK1_AD*P[0..7],BANK1_AD*N[0..7]
BANK1_MRCC/SRCC[0..7]
BANK1_T2_[0..7],BANK1_T3_[0..3]
BANK1_T0_[0..3]
BANK2_AD*P[0..7],BANK2_AD*N[0..7]
BANK2_MRCC/SRCC[0..7]
BANK2_T0_[0..3],BANK2_T2_[0..1]
BANK2_A[0..13]
BANK2_T3_[0..3]
ARIETTA_IO[0..5]

## Notes on the sheet
- FPGA Power | Arietta Power
- X1(SLOT1) SOUND/VGA
  X3(SLOT3) ANALOG
- X2(SLOT2) Reserve
  X4(SLOT4) I/O Expansion
- FPGA I/O für SLOTs werden
  über VCC_EXT betrieben
- FPGA I/O für SLOTs werden
  über VCC_EXT betrieben
- Leitungsimpedanz für Standard I/O 100Ohm (25+75)
  Leitungsimpedanz für Leistungs I/O 75 Ohm (25+50)
- Leitungsimpedanz für Standard I/O 100Ohm (25+75)
  Leitungsimpedanz für Leistungs I/O 75 Ohm (25+50)
- SDRAM Power
- Wenn SPI Bus/I2S inaktiv I2C Bus 0
  auf CS3/4 verfügbar!
- Wenn SPI Bus/I2S inaktiv I2C Bus 0
  auf CS3/4 verfügbar!
- I2S Modul
- BANK2
- BANK1
- SPI BUS an Slots nur verfügbar
  wenn SOUNDKARTE und I2C
  nicht aktiviert!
- SLOT SPI
- X3(SLOT3) ANALOG/DIGITAL Peripherie
  X4(SLOT4) Taster/LEDs/...
- RESERVE
- Bluetooth Power | USB HUB Power
- L=350n
  Type = BLM18PG221SN1D
- Step Down Converter
- FPGA Externe BANK Statusmeldung (optional)
- Injection Point 8x
- Mode Setup | USB  FIFO
- Port A: High-Speed (USB-Hub)
  Port B: High-Speed (WLAN-Modul)
  Port C: Full-Speed (Display)
  Hinweis:
  (microUSB Buchse kann nicht
  mehr verwendet werden)
- VCORE Ausgang
  liefert 1V8 keine
  Verb. notwendig
- UART Modul
- Umschalter Intern/Extern
- Verbindung zu Antenne
  in 50 Ohm Technik ausführen
  (50 Ohm Leiterbahn)
- U,I,P Messung 
  mit SPI Schnittstelle
- Nicht bestückt | Nicht bestückt
- SDRAM
- max. Taktfrequenz 167MHz
- JTAG Header
- Widerstand konfiguriert Device
  als USB Fullspeed . Bei diesem
  Chip nicht notwendig da bereits
  integriert daher nicht bestückt!
- SPI Modul
- UART Debug Modul
- Widerstand konfiguriert Device
  als USB Fullspeed
- USB Port 1
  (Extern)
- 12V
- Eingangsspannung
- NUF2221W1 ESD-Schutz
  für externe USB Buchsen
- FIFO max. Übertragungs-
  geschwindigkeit 1MBit/s
- Antennenbauteile müssen so nahe wie möglich
  an den Eingängen positioniert werden!
  (möglicherweise mit Abschirmung)
- FPGA Taktsignale
- CCLK1=100MHz
  CCLK2=24.576MHz
- USB Port 2
  (Extern)
- Serialmode | Linux Serial Console
- I2C/SPI Modul
- Lademmodul
- *Widerstandspositionierung (FPGA<->SDRAM)
  mittig für Datenbus (DQ,DQS), CLK, CKE;
  *Widerstandspositionierung (FPGA<->SDRAM)
  nahe am FPGA für unidirektionale Leitungen,
  Adressbus, Steuerbus
- Auf Mainboard
  nicht verwendet
- QuadSPI
- BLUETOOTH I/O Ports (12 Bit)
  Verbindungen auf externe Slots
- USB HUB EEPROM (optional)
- max. Schreibgeschwindigkeit 33MHz! | Testpunkt
- SMBUSZ=1 (I²C EEPROM)
  SMBUSZ=0 (SMBUS Host)
- Serialmode